# Altium project BC2087.PrjPcb (part 4 of 5)

## Sheet MID_AR0234.SchDoc: =project_title
size Tabloid; PageSetup: Record=PageOptions|CenterHorizontal=True|CenterVertical=True|PrintScale=0.71|XCorrection=1.00|YCorrection=1.00|PrintKind=0|BorderSize=5000000|LeftOffset=0|BottomOffset=0|Orientation=2|PaperLength=1000|PaperWidth=1000|Scale=100|PaperSource=7|PrintQuality=-4|MediaType=1|DitherType=10|PrintScaleMode=1|PaperKind=A4; CompanyName: Luxonis Holding; DrawnBy: Boris Chou / Blaz Kvas; Organization: Luxonis Holding; Address1: 1925 Harmony Park Drive; Address2: Westminster, CO; Address3: 80234; Address4: United States; DocumentNumber: D2088000; Revision: R3M1E3; SheetNumber: 5; SheetTotal: 11
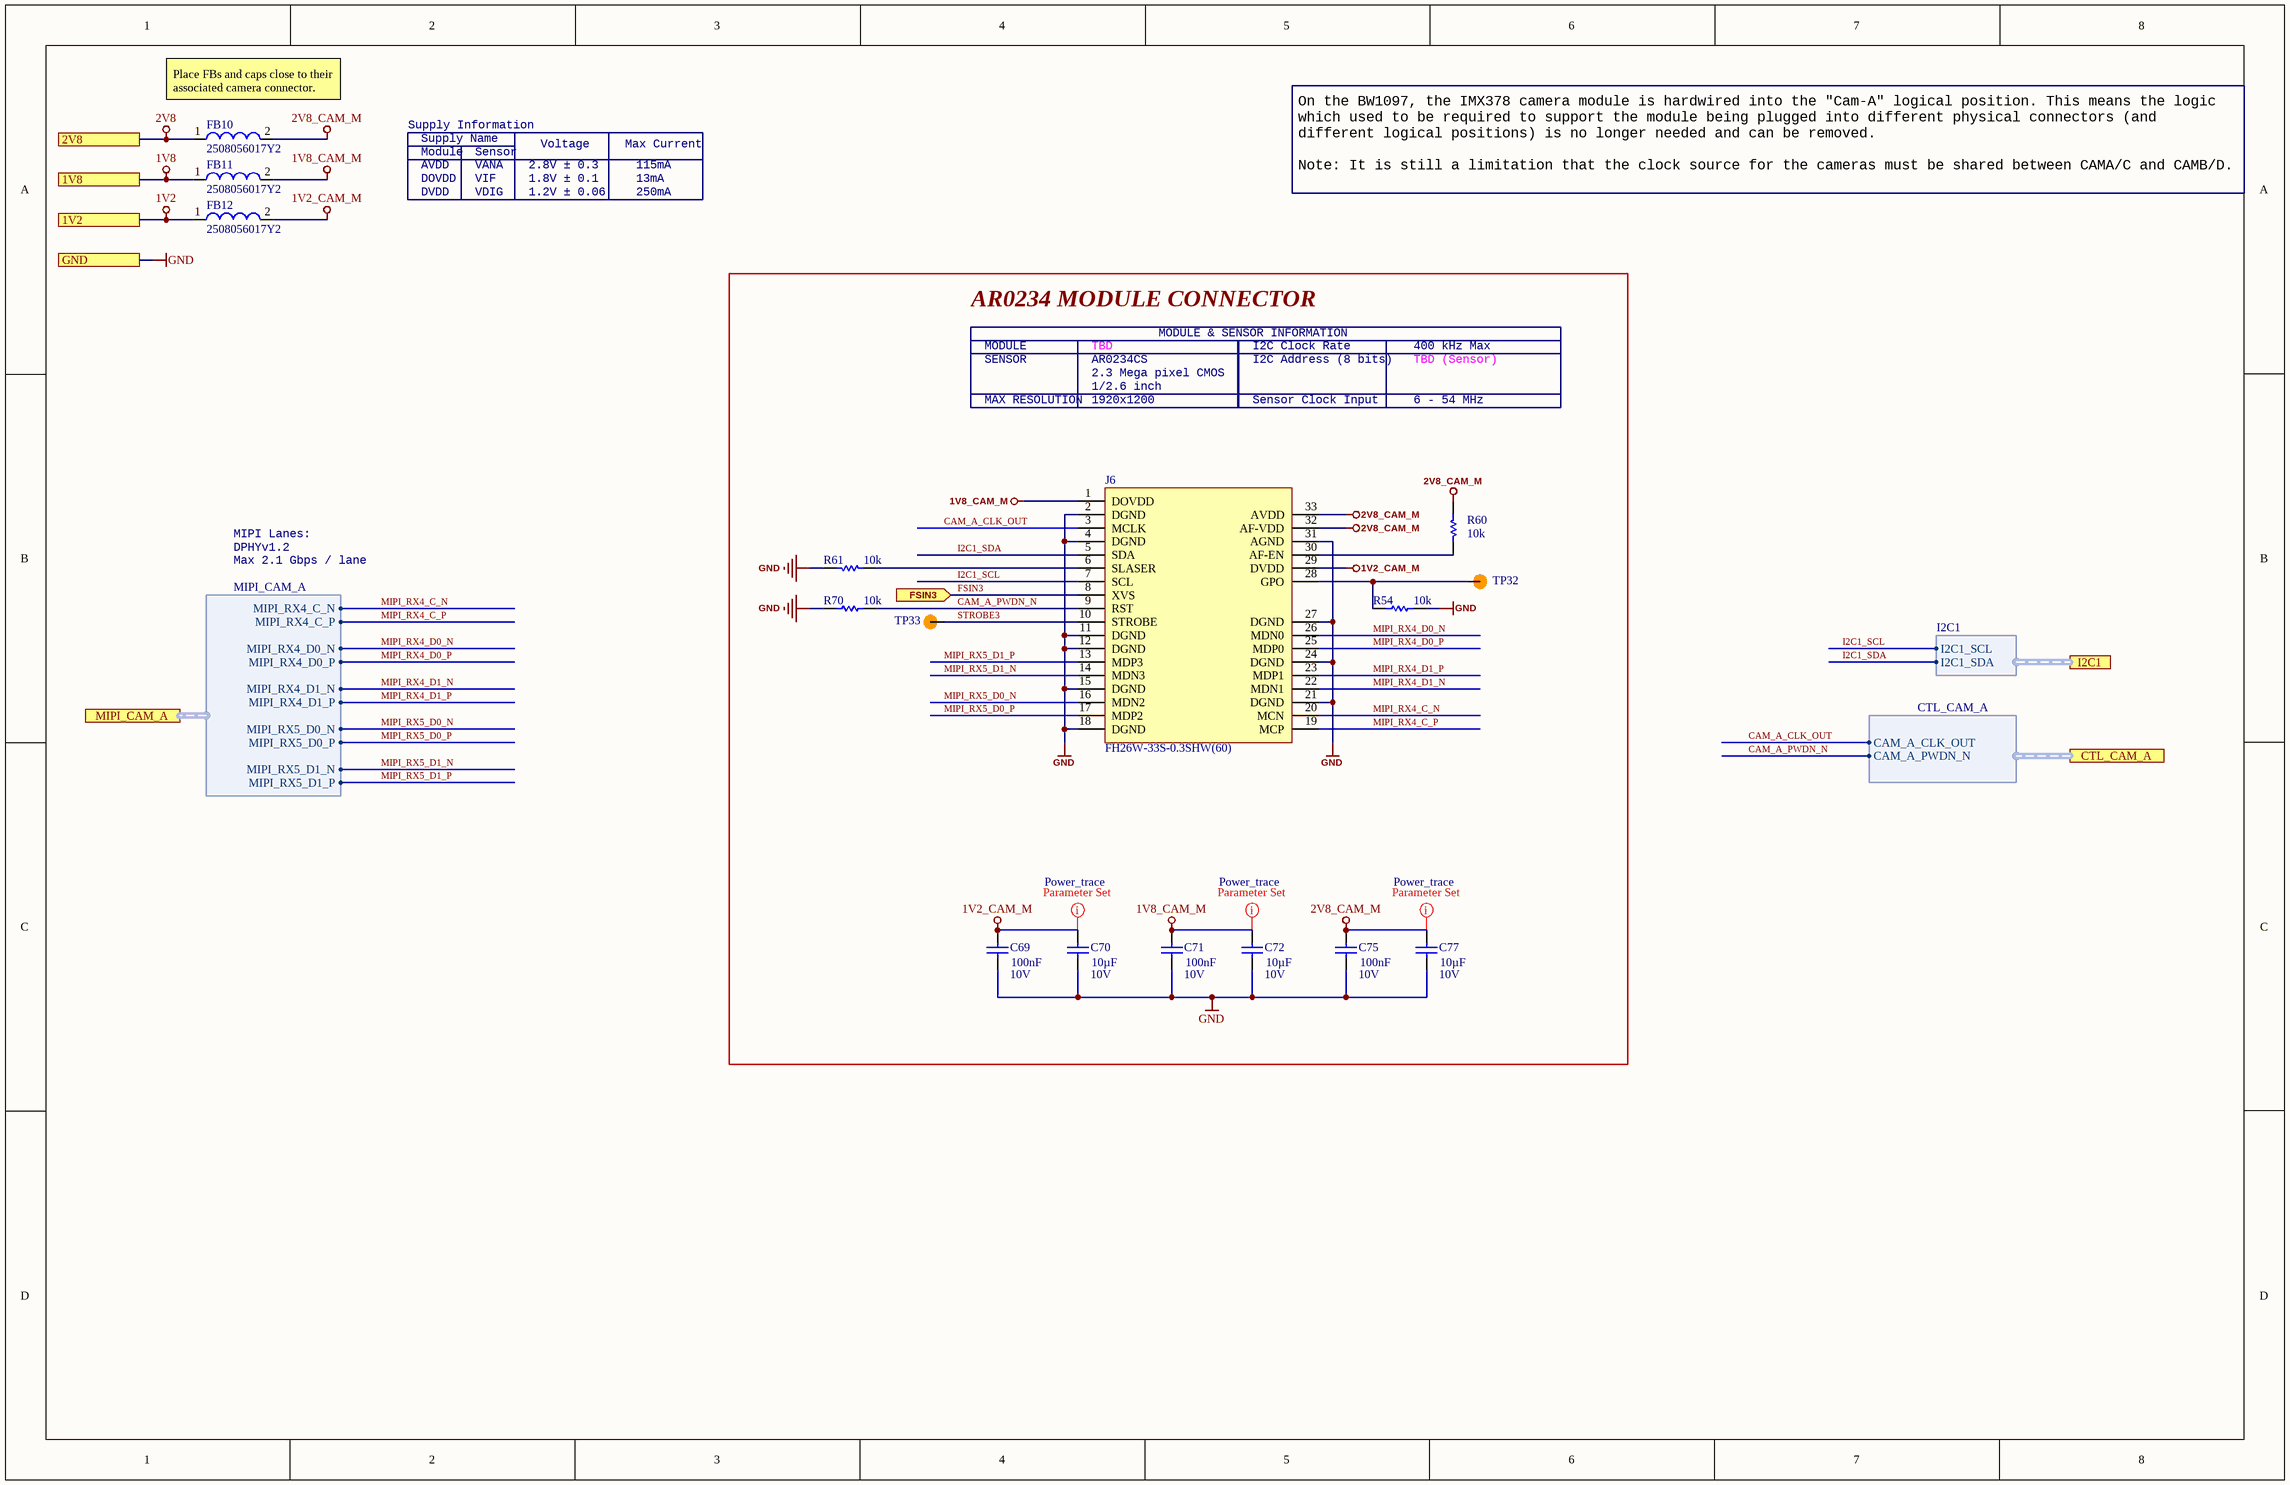
[diagram p10: MID_AR0234.SchDoc]

### Parts
C69  value 100nF  Voltage Rating: 10V  [CAPC0402(1005)70_L]  (hidden comment: GRM155R71A104JA01D)
C70  value 10µF  Voltage Rating: 10V  [CAPC0603(1608)100_L]  (hidden comment: GRM188R61A106ME69D)
C71  value 100nF  Voltage Rating: 10V  [CAPC0402(1005)70_L]  (hidden comment: GRM155R71A104JA01D)
C72  value 10µF  Voltage Rating: 10V  [CAPC0603(1608)100_L]  (hidden comment: GRM188R61A106ME69D)
C75  value 100nF  Voltage Rating: 10V  [CAPC0402(1005)70_L]  (hidden comment: GRM155R71A104JA01D)
C77  value 10µF  Voltage Rating: 10V  [CAPC0603(1608)100_L]  (hidden comment: GRM188R61A106ME69D)
FB10  2508056017Y2  [2508056017Y2]
FB11  2508056017Y2  [2508056017Y2]
FB12  2508056017Y2  [2508056017Y2]
J6  FH26W-33S-0.3SHW(60)  [FH26W-33S-0.3SHW(60)]
R54  value 10k  [RESC0402(1005)_L]  (hidden comment: RC0402FR-1310KL)
R60  value 10k  [RESC0402(1005)_L]  (hidden comment: RC0402FR-1310KL)
R61  value 10k  [RESC0402(1005)_L]  (hidden comment: RC0402FR-1310KL)
R70  value 10k  [RESC0402(1005)_L]  (hidden comment: RC0402FR-1310KL)
TP32  TEST_POINT  [TP100_200_NS]  (value not drawn)  (no BOM)
TP33  TEST_POINT  [TP100_200_NS]  (value not drawn)  (no BOM)

### Blocks framed on the sheet
AR0234 MODULE CONNECTOR: C69-C72 C75 C77 J6 R54 R60 R61 R70 TP32 TP33

### Ports
1V2, 1V8, 2V8, CTL_CAM_A (harness CTL_CAM_A), FSIN3 (in), GND, I2C1 (harness I2C1), MIPI_CAM_A (harness MIPI_CAM_A)

### Harnesses
I2C1: I2C1_SDA, I2C1_SCL
MIPI_CAM_A: MIPI_RX4_C_P, MIPI_RX4_C_N, MIPI_RX4_D0_P, MIPI_RX4_D0_N, MIPI_RX4_D1_P, MIPI_RX4_D1_N, MIPI_RX5_D0_P, MIPI_RX5_D0_N, MIPI_RX5_D1_P, MIPI_RX5_D1_N
CTL_CAM_A: CAM_A_PWDN_N, CAM_A_CLK_OUT

### Nets
1V2: FB12.1 ; port 1V2
1V2_CAM_M: C69.2 C70.2 FB12.2 J6.29(DVDD)
1V8: FB11.1 ; port 1V8
1V8_CAM_M: C71.2 C72.2 FB11.2 J6.1(DOVDD)
2V8: FB10.1 ; port 2V8
2V8_CAM_M: C75.2 C77.2 FB10.2 J6.32(AF-VDD) J6.33(AVDD) R60.1
GND: C69.1 C70.1 C71.1 C72.1 C75.1 C77.1 J6.2(DGND) J6.4(DGND) J6.11(DGND) J6.12(DGND) J6.15(DGND) J6.18(DGND) J6.21(DGND) J6.24(DGND) J6.27(DGND) J6.31(AGND) R54.2 R61.2 R70.1 ; port GND
CAM_A_CLK_OUT: J6.3(MCLK) ; port CTL_CAM_A.CAM_A_CLK_OUT
CAM_A_PWDN_N: J6.9(RST) R70.2 ; port CTL_CAM_A.CAM_A_PWDN_N
FSIN3: J6.8(XVS) ; port FSIN3
I2C1_SCL: J6.7(SCL) ; port I2C1.I2C1_SCL
I2C1_SDA: J6.5(SDA) ; port I2C1.I2C1_SDA
MIPI_RX4_C_N: J6.20(MCN) ; port MIPI_CAM_A.MIPI_RX4_C_N
MIPI_RX4_C_P: J6.19(MCP) ; port MIPI_CAM_A.MIPI_RX4_C_P
MIPI_RX4_D0_N: J6.26(MDN0) ; port MIPI_CAM_A.MIPI_RX4_D0_N
MIPI_RX4_D0_P: J6.25(MDP0) ; port MIPI_CAM_A.MIPI_RX4_D0_P
MIPI_RX4_D1_N: J6.22(MDN1) ; port MIPI_CAM_A.MIPI_RX4_D1_N
MIPI_RX4_D1_P: J6.23(MDP1) ; port MIPI_CAM_A.MIPI_RX4_D1_P
MIPI_RX5_D0_N: J6.16(MDN2) ; port MIPI_CAM_A.MIPI_RX5_D0_N
MIPI_RX5_D0_P: J6.17(MDP2) ; port MIPI_CAM_A.MIPI_RX5_D0_P
MIPI_RX5_D1_N: J6.14(MDN3) ; port MIPI_CAM_A.MIPI_RX5_D1_N
MIPI_RX5_D1_P: J6.13(MDP3) ; port MIPI_CAM_A.MIPI_RX5_D1_P
STROBE3: J6.10(STROBE) TP33.1
NetJ6_6: J6.6(SLASER) R61.1
NetJ6_28: J6.28(GPO) R54.1 TP32.1
NetJ6_30: J6.30(AF-EN) R60.2

### Layout directives
net class Power_trace: 1V2_CAM_M, 1V8_CAM_M, 2V8_CAM_M

### Notes on the sheet
- (near FB10) Place FBs and caps close to their associated camera connector.
- Supply Information
- AVDD
- Supply Name
- Module
- VANA
- Sensor
- 2.8V ± 0.3
- Voltage
- Max Current
- 115mA
- DOVDD
- DVDD
- VIF
- VDIG
- 1.8V ± 0.1
- 1.2V ± 0.06
- 13mA
- 250mA
- On the BW1097, the IMX378 camera module is hardwired into the "Cam-A" logical position. This means the logic which used to be required to support the module being plugged into different physical connectors (and different logical positions) is no longer needed and can be removed.
  Note: It is still a limitation that the clock source for the cameras must be shared between CAMA/C and CAMB/D.
- SENSOR
- MODULE
- AR0234CS
- TBD
- MODULE & SENSOR INFORMATION
- I2C Address (8 bits)
- I2C Clock Rate
- TBD (Sensor)
- 400 kHz Max
- MAX RESOLUTION
- 2.3 Mega pixel CMOS
- 1920x1200
- 1/2.6 inch
- Sensor Clock Input
- 6 - 54 MHz
- MIPI Lanes:
- Max 2.1 Gbps / lane
- DPHYv1.2
- Title
- Size:
- Date:
- Tabloid
- Number:
- Time:
- Revision:
- Sheet
- of
- Drawn by:

### Library data of the parts
C69 C71 C75 = CMP-108-000015-5: CAP CER 0.1UF 10V X7R 0402 5%; Manufacturer 1: Murata; Manufacturer Part Number 1: GRM155R71A104JA01D; Case/Package: 0402; Min Operating Temperature: -55°C; Max Operating Temperature: 125°C; Tolerance: 5%; Dielectric: X7R; Length: 1mm; Height: 0.5mm; Width: 0.02inch; Depth: 0.5mm; ComponentLink1URL: https://datasheet.ciiva.com/5411/product-5411135.pdf?src-supplier=Mouser; ComponentLink1Description: https://datasheet.ciiva.com/5411/product-5411135.pdf?src-supplier=Mouser; ComponentLink2URL: https://datasheet.ciiva.com/11618/c02e-11618821.pdf?src-supplier=Avnet; ComponentLink2Description: https://datasheet.ciiva.com/11618/c02e-11618821.pdf?src-supplier=Avnet; Design Item ID: GRM155R71A104JA01D; Mounting Technology: SMT
C70 C72 C77 = CMP-004-000018-4: CAP CER 10UF 10V X5R 0603 20%; Manufacturer 1: Murata; Manufacturer Part Number 1: GRM188R61A106ME69D; Case/Package: 0603; Min Operating Temperature: -55°C; Max Operating Temperature: 85°C; Tolerance: 20%; Dielectric: X5R; Length: 1.6mm; Height: 0.8mm; Width: 0.8mm; Depth: 0.8mm; ComponentLink1URL: http://www.mouser.com/ds/2/281/c02e-2905.pdf?src-supplier=Mouser; ComponentLink1Description: http://www.mouser.com/ds/2/281/c02e-2905.pdf?src-supplier=Mouser; ComponentLink2URL: http://components.arrow.com/part/dataview/0323_06119472?src-supplier=Arrow+Europe; ComponentLink2Description: http://components.arrow.com/part/dataview/0323_06119472?src-supplier=Arrow+Europe; ComponentLink3URL: http://www.farnell.com/datasheets/2048014.pdf?src-supplier=Farnell; ComponentLink3Description: http://www.farnell.com/datasheets/2048014.pdf?src-supplier=Farnell; ComponentLink4URL: http://www.farnell.com/datasheets/1872210.pdf?src-supplier=Farnell; ComponentLink4Description: http://www.farnell.com/datasheets/1872210.pdf?src-supplier=Farnell; ComponentLink5URL: http://search.murata.co.jp/Ceramy/image/img/A01X/G101/ENG/GRM188R61A106ME69-01.pdf?src-supplier=Digi-Key; ComponentLink5Description: http://search.murata.co.jp/Ceramy/image/img/A01X/G101/ENG/GRM188R61A106ME69-01.pdf?src-supplier=Digi-Key; ComponentLink6URL: http://www.farnell.com/datasheets/1872210.pdf?src-supplier=Newark; ComponentLink6Description: http://www.farnell.com/datasheets/1872210.pdf?src-supplier=Newark; ComponentLink7URL: http://www.farnell.com/datasheets/2048014.pdf?src-supplier=Element14; ComponentLink7Description: http://www.farnell.com/datasheets/2048014.pdf?src-supplier=Element14; ComponentLink8URL: http://www.farnell.com/datasheets/2048014.pdf?src-supplier=Newark; ComponentLink8Description: http://www.farnell.com/datasheets/2048014.pdf?src-supplier=Newark; Design Item ID: GRM188R61A106ME69D; Mounting Technology: SMT
FB10-FB12 = CMP-082-000000-2: FERRITE BEAD, 0.1OHM, 2A, 0805, 600R/100MHz; Manufacturer 1: Fair-Rite; Tolerance: 25%; Manufacturer Part Number 1: 2508056017Y2; Case/Package: 0805; Current Rating: 2A
J6 = CMP-002-00090-3: FFC/FPC Connector, 33 Contact(s), 1 Row(s), Female, Right Angle, Surface Mount Terminal; Manufacturer 1: Hirose; Manufacturer Part Number 1: FH26W-33S-0.3SHW(60); RoHS: Yes; Category: FFC / FPC; Stock 1: 627; Pricing 1: 1=1,78000, 10=1,61700, 25=1,51800, 50=1,45200, 100=1,38600, 250=1,25400, 500=1,15500, 1000=0,99000, 2500=0,92400 (USD); ComponentLink1URL: https://datasheet.ciiva.com:443/pdfs/VipMasterIC/IC/HIRO/HIRO-S-A0007913874/HIRO-S-A0008593114-1.pdf?src-supplier=IHS+Markit; ComponentLink1Description: https://datasheet.ciiva.com:443/pdfs/VipMasterIC/IC/HIRO/HIRO-S-A0007913874/HIRO-S-A0008593114-1.pdf?src-supplier=IHS+Markit; ComponentLink2URL: https://www.hirose.com/product/en/download_file/key_name/FH26/category/Catalog/doc_file_id/49355/?file_category_id=4&item_id=298&is_series=1&src-supplier=Digi-Key; ComponentLink2Description: https://www.hirose.com/product/en/download_file/key_name/FH26/category/Catalog/doc_file_id/49355/?file_category_id=4&item_id=298&is_series=1&src-supplier=Digi-Key; ComponentLink3URL: https://www.hirose.com/product/download/?distributor=digikey&amp;type=2d&amp;lang=en&amp;num=FH26W-13S-0.3SHW(60)&src-supplier=Digi-Key; ComponentLink3Description: https://www.hirose.com/product/download/?distributor=digikey&amp;type=2d&amp;lang=en&amp;num=FH26W-13S-0.3SHW(60)&src-supplier=Digi-Key; Design Item ID: FH26W-33S-0.3SHW(60); Pins: 33; Source: LuxonisMaster.SchLib
R54 R60 R61 R70 = CMP-115-000004-8: RES SMD 10K OHM 1% 1/16W 0402; Manufacturer 1: Yageo; Temperature Coefficient: 100ppm/°C; Power Rating: 62.5mW; Voltage Rating: 50V; Manufacturer Part Number 1: RC0402FR-1310KL; Case/Package: 0402; Min Operating Temperature: -55°C; Max Operating Temperature: 155°C; Tolerance: 1%; Design Item ID: RC0402FR-1310KL
TP32 TP33 = CMP-015-000000-2: Manufacturer Part Number 1: /; Design Item ID: TEST_POINT; Source: LuxonisMaster.SchLib

## Sheet RIGHT_AR0234.SchDoc: =project_title
size Tabloid; CompanyName: Luxonis Holding; DrawnBy: Boris Chou / Blaz Kvas; Organization: Luxonis Holding; Address1: 1925 Harmony Park Drive; Address2: Westminster, CO; Address3: 80234; Address4: United States; DocumentNumber: D2088000; Revision: R3M1E3; SheetNumber: 10; SheetTotal: 11
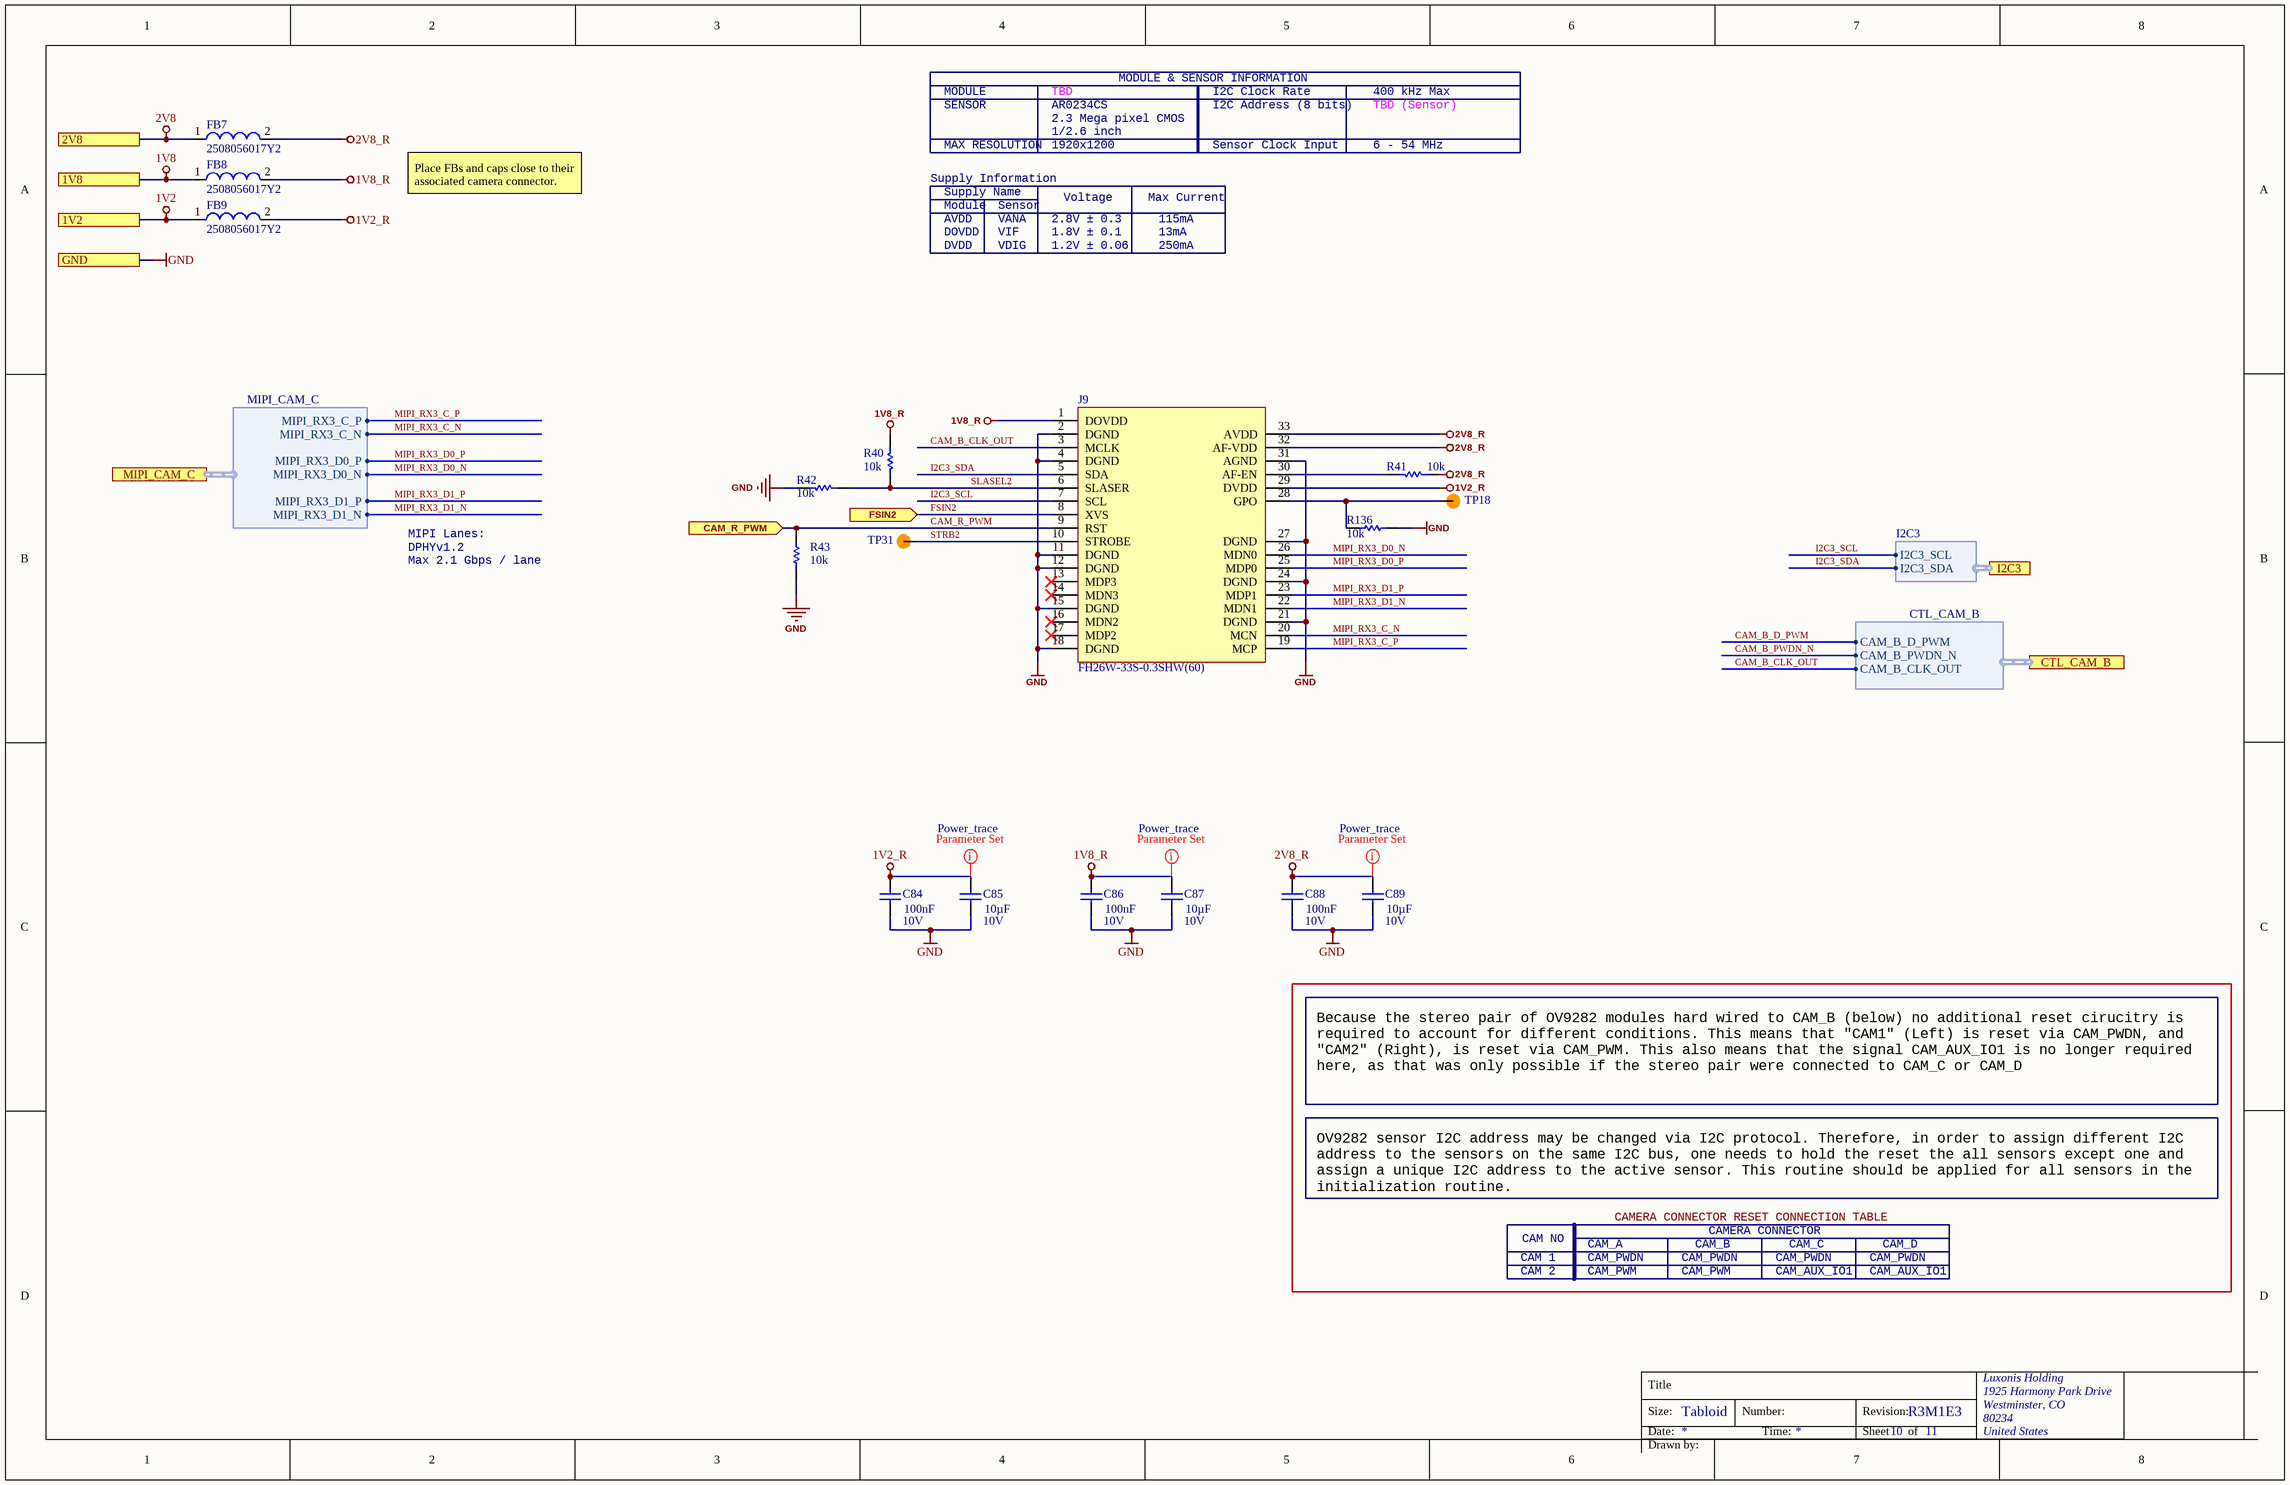
[diagram p11: RIGHT_AR0234.SchDoc]

### Parts
C84  value 100nF  Voltage Rating: 10V  [CAPC0402(1005)70_L]  (hidden comment: GRM155R71A104JA01D)
C85  value 10µF  Voltage Rating: 10V  [CAPC0603(1608)100_L]  (hidden comment: GRM188R61A106ME69D)
C86  value 100nF  Voltage Rating: 10V  [CAPC0402(1005)70_L]  (hidden comment: GRM155R71A104JA01D)
C87  value 10µF  Voltage Rating: 10V  [CAPC0603(1608)100_L]  (hidden comment: GRM188R61A106ME69D)
C88  value 100nF  Voltage Rating: 10V  [CAPC0402(1005)70_L]  (hidden comment: GRM155R71A104JA01D)
C89  value 10µF  Voltage Rating: 10V  [CAPC0603(1608)100_L]  (hidden comment: GRM188R61A106ME69D)
FB7  2508056017Y2  [2508056017Y2]
FB8  2508056017Y2  [2508056017Y2]
FB9  2508056017Y2  [2508056017Y2]
J9  FH26W-33S-0.3SHW(60)  [FH26W-33S-0.3SHW(60)]
R40  value 10k  [RESC0402(1005)_L]  (hidden comment: RC0402FR-1310KL)
R41  value 10k  [RESC0402(1005)_L]  (hidden comment: RC0402FR-1310KL)
R42  value 10k  [RESC0402(1005)_L]  (hidden comment: RC0402FR-1310KL)
R43  value 10k  [RESC0402(1005)_L]  (hidden comment: RC0402FR-1310KL)
R136  value 10k  [RESC0402(1005)_L]  (hidden comment: RC0402FR-1310KL)
TP18  TEST_POINT  [TP100_200_NS]  (value not drawn)  (no BOM)
TP31  TEST_POINT  [TP100_200_NS]  (value not drawn)  (no BOM)

### Ports
1V2, 1V8, 2V8, CAM_R_PWM (in), CTL_CAM_B (harness CTL_CAM_B), FSIN2 (in), GND, I2C3 (harness I2C3), MIPI_CAM_C (harness MIPI_CAM_C)

### Harnesses
MIPI_CAM_C: MIPI_RX3_C_P, MIPI_RX3_C_N, MIPI_RX3_D0_P, MIPI_RX3_D0_N, MIPI_RX3_D1_P, MIPI_RX3_D1_N
I2C3: I2C3_SDA, I2C3_SCL
CTL_CAM_B: CAM_B_CLK_OUT, CAM_B_PWDN_N, CAM_B_D_PWM

### Nets
1V2: FB9.1 ; port 1V2
1V2_R: C84.2 C85.2 FB9.2 J9.29(DVDD)
1V8: FB8.1 ; port 1V8
1V8_R: C86.2 C87.2 FB8.2 J9.1(DOVDD) R40.1
2V8: FB7.1 ; port 2V8
2V8_R: C88.2 C89.2 FB7.2 J9.32(AF-VDD) J9.33(AVDD) R41.2
GND: C84.1 C85.1 C86.1 C87.1 C88.1 C89.1 J9.2(DGND) J9.4(DGND) J9.11(DGND) J9.12(DGND) J9.15(DGND) J9.18(DGND) J9.21(DGND) J9.24(DGND) J9.27(DGND) J9.31(AGND) R42.1 R43.1 R136.2 ; port GND
CAM_B_CLK_OUT: J9.3(MCLK) ; port CTL_CAM_B.CAM_B_CLK_OUT
CAM_R_PWM: J9.9(RST) R43.2 ; port CAM_R_PWM
FSIN2: J9.8(XVS) ; port FSIN2
I2C3_SCL: J9.7(SCL) ; port I2C3.I2C3_SCL
I2C3_SDA: J9.5(SDA) ; port I2C3.I2C3_SDA
MIPI_RX3_C_N: J9.20(MCN) ; port MIPI_CAM_C.MIPI_RX3_C_N
MIPI_RX3_C_P: J9.19(MCP) ; port MIPI_CAM_C.MIPI_RX3_C_P
MIPI_RX3_D0_N: J9.26(MDN0) ; port MIPI_CAM_C.MIPI_RX3_D0_N
MIPI_RX3_D0_P: J9.25(MDP0) ; port MIPI_CAM_C.MIPI_RX3_D0_P
MIPI_RX3_D1_N: J9.22(MDN1) ; port MIPI_CAM_C.MIPI_RX3_D1_N
MIPI_RX3_D1_P: J9.23(MDP1) ; port MIPI_CAM_C.MIPI_RX3_D1_P
SLASEL2: J9.6(SLASER) R40.2 R42.2
STRB2: J9.10(STROBE) TP31.1
NetJ9_28: J9.28(GPO) R136.1 TP18.1
NetJ9_30: J9.30(AF-EN) R41.1

Not connected (* = marked no-connect by the designer): J9 13(MDP3)* 14(MDN3)* 16(MDN2)* 17(MDP2)*

### Layout directives
net class Power_trace: 1V2_R, 1V8_R, 2V8_R

### Notes on the sheet
- MODULE
- TBD
- MODULE & SENSOR INFORMATION
- I2C Clock Rate
- 400 kHz Max
- SENSOR
- MAX RESOLUTION
- 2.3 Mega pixel CMOS
- 1920x1200
- AR0234CS
- 1/2.6 inch
- I2C Address (8 bits)
- Sensor Clock Input
- TBD (Sensor)
- 6 - 54 MHz
- Place FBs and caps close to their associated camera connector.
- Supply Information
- AVDD
- Supply Name
- Module
- VANA
- Sensor
- 2.8V ± 0.3
- Voltage
- Max Current
- 115mA
- DOVDD
- DVDD
- VIF
- VDIG
- 1.8V ± 0.1
- 1.2V ± 0.06
- 13mA
- 250mA
- MIPI Lanes:
- Max 2.1 Gbps / lane
- DPHYv1.2
- Because the stereo pair of OV9282 modules hard wired to CAM_B (below) no additional reset cirucitry is required to account for different conditions. This means that "CAM1" (Left) is reset via CAM_PWDN, and "CAM2" (Right), is reset via CAM_PWM. This also means that the signal CAM_AUX_IO1 is no longer required here, as that was only possible if the stereo pair were connected to CAM_C or CAM_D
- OV9282 sensor I2C address may be changed via I2C protocol. Therefore, in order to assign different I2C address to the sensors on the same I2C bus, one needs to hold the reset the all sensors except one and assign a unique I2C address to the active sensor. This routine should be applied for all sensors in the initialization routine.
- CAMERA CONNECTOR RESET CONNECTION TABLE
- CAMERA CONNECTOR
- CAM 1
- CAM 2
- CAM NO
- CAM_A
- CAM_PWDN
- CAM_PWM
- CAM_B
- CAM_AUX_IO1
- CAM_C
- CAM_D
- Title
- Size:
- Date:
- Tabloid
- Number:
- Time:
- Revision:
- Sheet
- of
- Drawn by:

### Library data of the parts
C84 C86 C88 = CMP-108-000015-5: as C69 on sheet MID_AR0234; Manufacturer Part Number 1: GRM155R71A104JA01D; Case/Package: 0402; Min Operating Temperature: -55°C; Max Operating Temperature: 125°C; Tolerance: 5%; Dielectric: X7R; Length: 1mm; Height: 0.5mm; Width: 0.02inch; Depth: 0.5mm; ComponentLink1URL: https://datasheet.ciiva.com/5411/product-5411135.pdf?src-supplier=Mouser; ComponentLink1Description: https://datasheet.ciiva.com/5411/product-5411135.pdf?src-supplier=Mouser; ComponentLink2URL: https://datasheet.ciiva.com/11618/c02e-11618821.pdf?src-supplier=Avnet; ComponentLink2Description: https://datasheet.ciiva.com/11618/c02e-11618821.pdf?src-supplier=Avnet; Design Item ID: GRM155R71A104JA01D; Mounting Technology: SMT
C85 C87 C89 = CMP-004-000018-4: as C70 on sheet MID_AR0234; Manufacturer Part Number 1: GRM188R61A106ME69D; Case/Package: 0603; Min Operating Temperature: -55°C; Max Operating Temperature: 85°C; Tolerance: 20%; Dielectric: X5R; Length: 1.6mm; Height: 0.8mm; Width: 0.8mm; Depth: 0.8mm; ComponentLink1URL: http://www.mouser.com/ds/2/281/c02e-2905.pdf?src-supplier=Mouser; ComponentLink1Description: http://www.mouser.com/ds/2/281/c02e-2905.pdf?src-supplier=Mouser; ComponentLink2URL: http://components.arrow.com/part/dataview/0323_06119472?src-supplier=Arrow+Europe; ComponentLink2Description: http://components.arrow.com/part/dataview/0323_06119472?src-supplier=Arrow+Europe; ComponentLink3URL: http://www.farnell.com/datasheets/2048014.pdf?src-supplier=Farnell; ComponentLink3Description: http://www.farnell.com/datasheets/2048014.pdf?src-supplier=Farnell; ComponentLink4URL: http://www.farnell.com/datasheets/1872210.pdf?src-supplier=Farnell; ComponentLink4Description: http://www.farnell.com/datasheets/1872210.pdf?src-supplier=Farnell; ComponentLink5URL: http://search.murata.co.jp/Ceramy/image/img/A01X/G101/ENG/GRM188R61A106ME69-01.pdf?src-supplier=Digi-Key; ComponentLink5Description: http://search.murata.co.jp/Ceramy/image/img/A01X/G101/ENG/GRM188R61A106ME69-01.pdf?src-supplier=Digi-Key; ComponentLink6URL: http://www.farnell.com/datasheets/1872210.pdf?src-supplier=Newark; ComponentLink6Description: http://www.farnell.com/datasheets/1872210.pdf?src-supplier=Newark; ComponentLink7URL: http://www.farnell.com/datasheets/2048014.pdf?src-supplier=Element14; ComponentLink7Description: http://www.farnell.com/datasheets/2048014.pdf?src-supplier=Element14; ComponentLink8URL: http://www.farnell.com/datasheets/2048014.pdf?src-supplier=Newark; ComponentLink8Description: http://www.farnell.com/datasheets/2048014.pdf?src-supplier=Newark; Design Item ID: GRM188R61A106ME69D; Mounting Technology: SMT
FB7-FB9 = CMP-082-000000-2: as FB10 on sheet MID_AR0234; Manufacturer Part Number 1: 2508056017Y2; Case/Package: 0805; Current Rating: 2A
J9 = CMP-002-00090-3: as J6 on sheet MID_AR0234; Manufacturer Part Number 1: FH26W-33S-0.3SHW(60); RoHS: Yes; Category: FFC / FPC; Stock 1: 627; Pricing 1: 1=1,78000, 10=1,61700, 25=1,51800, 50=1,45200, 100=1,38600, 250=1,25400, 500=1,15500, 1000=0,99000, 2500=0,92400 (USD); ComponentLink1URL: https://datasheet.ciiva.com:443/pdfs/VipMasterIC/IC/HIRO/HIRO-S-A0007913874/HIRO-S-A0008593114-1.pdf?src-supplier=IHS+Markit; ComponentLink1Description: https://datasheet.ciiva.com:443/pdfs/VipMasterIC/IC/HIRO/HIRO-S-A0007913874/HIRO-S-A0008593114-1.pdf?src-supplier=IHS+Markit; ComponentLink2URL: https://www.hirose.com/product/en/download_file/key_name/FH26/category/Catalog/doc_file_id/49355/?file_category_id=4&item_id=298&is_series=1&src-supplier=Digi-Key; ComponentLink2Description: https://www.hirose.com/product/en/download_file/key_name/FH26/category/Catalog/doc_file_id/49355/?file_category_id=4&item_id=298&is_series=1&src-supplier=Digi-Key; ComponentLink3URL: https://www.hirose.com/product/download/?distributor=digikey&amp;type=2d&amp;lang=en&amp;num=FH26W-13S-0.3SHW(60)&src-supplier=Digi-Key; ComponentLink3Description: https://www.hirose.com/product/download/?distributor=digikey&amp;type=2d&amp;lang=en&amp;num=FH26W-13S-0.3SHW(60)&src-supplier=Digi-Key; Design Item ID: FH26W-33S-0.3SHW(60); Pins: 33; Source: LuxonisMaster.SchLib
R40-R43 R136 = CMP-115-000004-8: as R54 on sheet MID_AR0234; Manufacturer Part Number 1: RC0402FR-1310KL; Case/Package: 0402; Min Operating Temperature: -55°C; Max Operating Temperature: 155°C; Tolerance: 1%; Design Item ID: RC0402FR-1310KL
TP18 TP31 = CMP-015-000000-2: Manufacturer Part Number 1: /; Design Item ID: TEST_POINT; Source: LuxonisMaster.SchLib

## Sheet LEFT_AR0234.SchDoc: =project_title
size Tabloid; PageSetup: Record=PageOptions|CenterHorizontal=True|CenterVertical=True|PrintScale=0.71|XCorrection=1.00|YCorrection=1.00|PrintKind=0|BorderSize=5000000|LeftOffset=0|BottomOffset=0|Orientation=2|PaperLength=1000|PaperWidth=1000|Scale=100|PaperSource=7|PrintQuality=-4|MediaType=1|DitherType=10|PrintScaleMode=1|PaperKind=A4; CompanyName: Luxonis Holding; DrawnBy: Boris Chou / Blaz Kvas; Organization: Luxonis Holding; Address1: 1925 Harmony Park Drive; Address2: Westminster, CO; Address3: 80234; Address4: United States; DocumentNumber: D2088000; Revision: R3M1E3; SheetNumber: 6; SheetTotal: 11
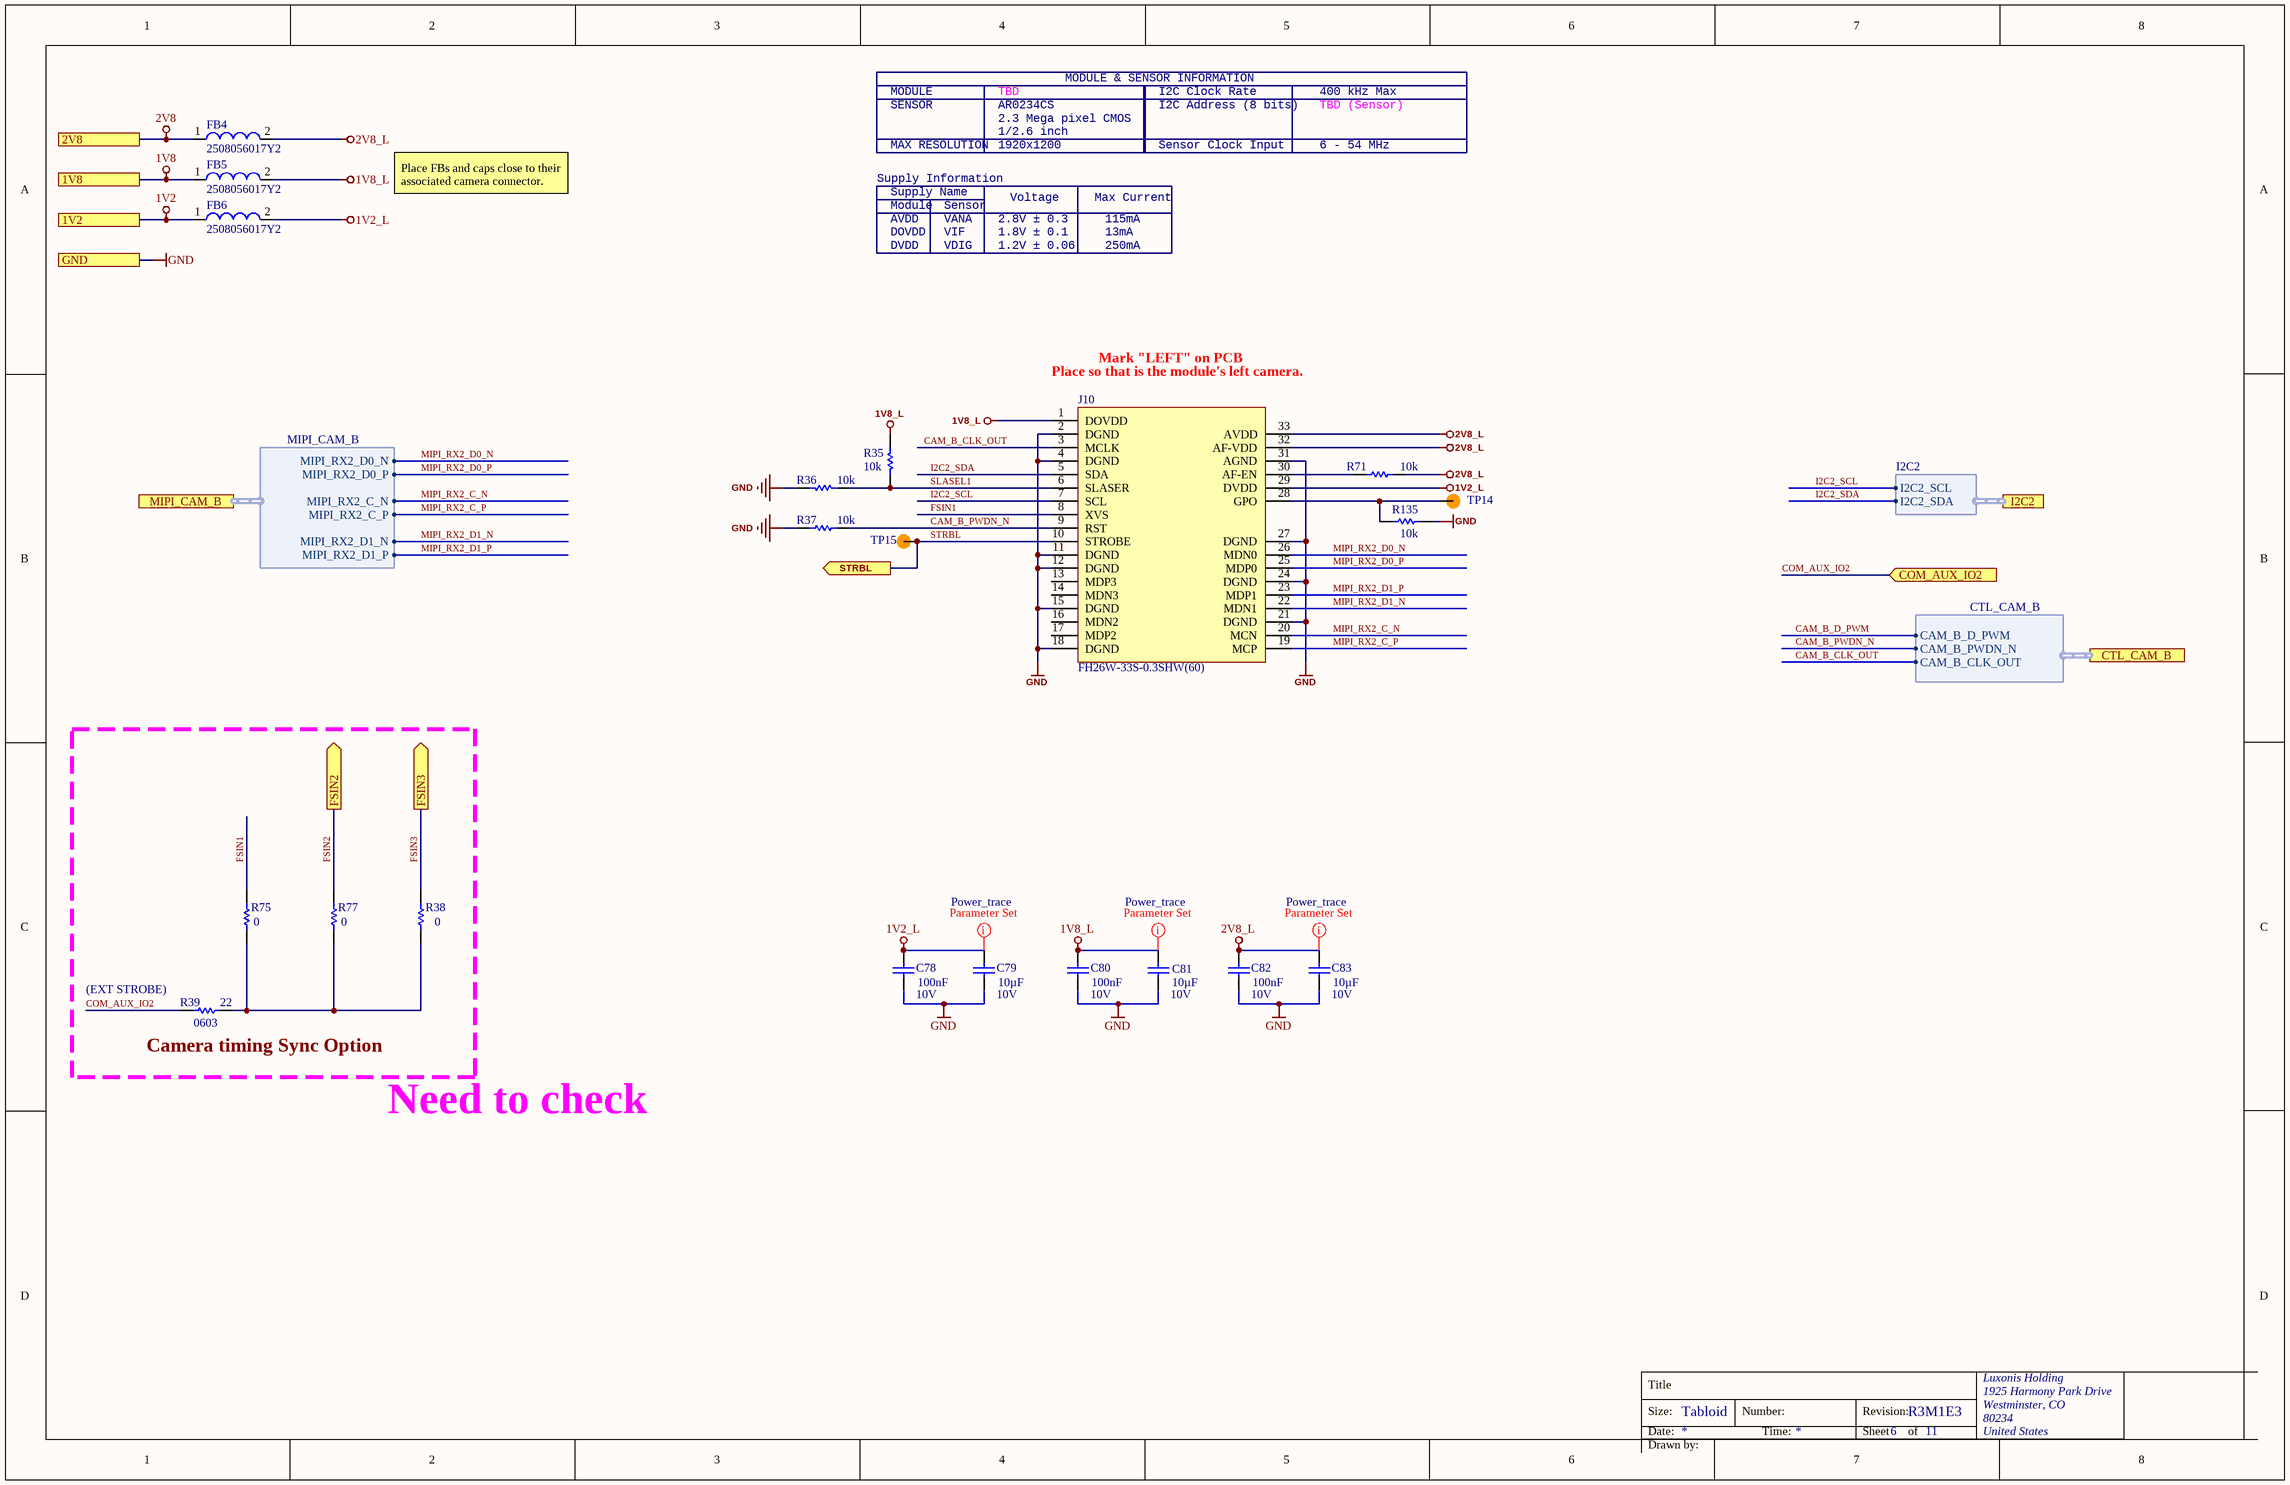
[diagram p12: LEFT_AR0234.SchDoc]

### Parts
C78  value 100nF  Voltage Rating: 10V  [CAPC0402(1005)70_L]  (hidden comment: GRM155R71A104JA01D)
C79  value 10µF  Voltage Rating: 10V  [CAPC0603(1608)100_L]  (hidden comment: GRM188R61A106ME69D)
C80  value 100nF  Voltage Rating: 10V  [CAPC0402(1005)70_L]  (hidden comment: GRM155R71A104JA01D)
C81  value 10µF  Voltage Rating: 10V  [CAPC0603(1608)100_L]  (hidden comment: GRM188R61A106ME69D)
C82  value 100nF  Voltage Rating: 10V  [CAPC0402(1005)70_L]  (hidden comment: GRM155R71A104JA01D)
C83  value 10µF  Voltage Rating: 10V  [CAPC0603(1608)100_L]  (hidden comment: GRM188R61A106ME69D)
FB4  2508056017Y2  [2508056017Y2]
FB5  2508056017Y2  [2508056017Y2]
FB6  2508056017Y2  [2508056017Y2]
J10  FH26W-33S-0.3SHW(60)  [FH26W-33S-0.3SHW(60)]
R35  value 10k  [RESC0402(1005)_L]  (hidden comment: RC0402FR-1310KL)
R36  value 10k  [RESC0402(1005)_L]  (hidden comment: RC0402FR-1310KL)
R37  value 10k  [RESC0402(1005)_L]  (hidden comment: RC0402FR-1310KL)
R38  value 0  [RESC0603(1608)_L]  (hidden comment: CRCW06030000Z0EA)
R39  value 22  Case/Package: 0603  [RESC0603(1608)_L]  (hidden comment: RC0603FR-0722RL)
R71  value 10k  [RESC0402(1005)_L]  (hidden comment: RC0402FR-1310KL)
R75  value 0  [RESC0603(1608)_L]  (hidden comment: CRCW06030000Z0EA)
R77  value 0  [RESC0603(1608)_L]  (hidden comment: CRCW06030000Z0EA)
R135  value 10k  [RESC0402(1005)_L]  (hidden comment: RC0402FR-1310KL)
TP14  TEST_POINT  [TP100_200_NS]  (value not drawn)  (no BOM)
TP15  TEST_POINT  [TP100_200_NS]  (value not drawn)  (no BOM)

### Blocks framed on the sheet
Camera timing Sync Option: R38 R39 R75 R77

### Ports
1V2, 1V8, 2V8, COM_AUX_IO2 (in), CTL_CAM_B (harness CTL_CAM_B), FSIN2 (out), FSIN3 (out), GND, I2C2 (harness I2C2), MIPI_CAM_B (harness MIPI_CAM_B), STRBL (out)

### Harnesses
I2C2: I2C2_SDA, I2C2_SCL
MIPI_CAM_B: MIPI_RX2_D1_P, MIPI_RX2_D1_N, MIPI_RX2_D0_N, MIPI_RX2_D0_P, MIPI_RX2_C_N, MIPI_RX2_C_P
CTL_CAM_B: CAM_B_CLK_OUT, CAM_B_PWDN_N, CAM_B_D_PWM

### Nets
1V2: FB6.1 ; port 1V2
1V2_L: C78.2 C79.2 FB6.2 J10.29(DVDD)
1V8: FB5.1 ; port 1V8
1V8_L: C80.2 C81.2 FB5.2 J10.1(DOVDD) R35.1
2V8: FB4.1 ; port 2V8
2V8_L: C82.2 C83.2 FB4.2 J10.32(AF-VDD) J10.33(AVDD) R71.2
GND: C78.1 C79.1 C80.1 C81.1 C82.1 C83.1 J10.2(DGND) J10.4(DGND) J10.11(DGND) J10.12(DGND) J10.15(DGND) J10.18(DGND) J10.21(DGND) J10.24(DGND) J10.27(DGND) J10.31(AGND) R36.1 R37.2 R135.2 ; port GND
CAM_B_CLK_OUT: J10.3(MCLK) ; port CTL_CAM_B.CAM_B_CLK_OUT
CAM_B_PWDN_N: J10.9(RST) R37.1 ; port CTL_CAM_B.CAM_B_PWDN_N
COM_AUX_IO2: R39.2 ; port COM_AUX_IO2
FSIN1: J10.8(XVS) R75.2
FSIN2: R77.2 ; port FSIN2
FSIN3: R38.2 ; port FSIN3
I2C2_SCL: J10.7(SCL) ; port I2C2.I2C2_SCL
I2C2_SDA: J10.5(SDA) ; port I2C2.I2C2_SDA
MIPI_RX2_C_N: J10.20(MCN) ; port MIPI_CAM_B.MIPI_RX2_C_N
MIPI_RX2_C_P: J10.19(MCP) ; port MIPI_CAM_B.MIPI_RX2_C_P
MIPI_RX2_D0_N: J10.26(MDN0) ; port MIPI_CAM_B.MIPI_RX2_D0_N
MIPI_RX2_D0_P: J10.25(MDP0) ; port MIPI_CAM_B.MIPI_RX2_D0_P
MIPI_RX2_D1_N: J10.22(MDN1) ; port MIPI_CAM_B.MIPI_RX2_D1_N
MIPI_RX2_D1_P: J10.23(MDP1) ; port MIPI_CAM_B.MIPI_RX2_D1_P
SLASEL1: J10.6(SLASER) R35.2 R36.2
STRBL: J10.10(STROBE) TP15.1 ; port STRBL
NetJ10_28: J10.28(GPO) R135.1 TP14.1
NetJ10_30: J10.30(AF-EN) R71.1
NetR38_1: R38.1 R39.1 R75.1 R77.1

Not connected (* = marked no-connect by the designer): J10 13(MDP3) 14(MDN3) 16(MDN2) 17(MDP2)

### Layout directives
net class Power_trace: 1V2_L, 1V8_L, 2V8_L

### Notes on the sheet
- MODULE
- TBD
- MODULE & SENSOR INFORMATION
- I2C Clock Rate
- 400 kHz Max
- SENSOR
- MAX RESOLUTION
- 2.3 Mega pixel CMOS
- 1920x1200
- AR0234CS
- 1/2.6 inch
- I2C Address (8 bits)
- Sensor Clock Input
- TBD (Sensor)
- 6 - 54 MHz
- Place FBs and caps close to their associated camera connector.
- Supply Information
- AVDD
- Supply Name
- Module
- VANA
- Sensor
- 2.8V ± 0.3
- Voltage
- Max Current
- 115mA
- DOVDD
- DVDD
- VIF
- VDIG
- 1.8V ± 0.1
- 1.2V ± 0.06
- 13mA
- 250mA
- Mark "LEFT" on PCB
- (near J10) Place so that is the module's left camera.
- (near R39) (EXT STROBE)
- Need to check
- Title
- Size:
- Date:
- Tabloid
- Number:
- Time:
- Revision:
- Sheet
- of
- Drawn by:

### Library data of the parts
C78 C80 C82 = CMP-108-000015-5: as C69 on sheet MID_AR0234; Manufacturer Part Number 1: GRM155R71A104JA01D; Case/Package: 0402; Min Operating Temperature: -55°C; Max Operating Temperature: 125°C; Tolerance: 5%; Dielectric: X7R; Length: 1mm; Height: 0.5mm; Width: 0.02inch; Depth: 0.5mm; ComponentLink1URL: https://datasheet.ciiva.com/5411/product-5411135.pdf?src-supplier=Mouser; ComponentLink1Description: https://datasheet.ciiva.com/5411/product-5411135.pdf?src-supplier=Mouser; ComponentLink2URL: https://datasheet.ciiva.com/11618/c02e-11618821.pdf?src-supplier=Avnet; ComponentLink2Description: https://datasheet.ciiva.com/11618/c02e-11618821.pdf?src-supplier=Avnet; Design Item ID: GRM155R71A104JA01D; Mounting Technology: SMT
C79 C81 C83 = CMP-004-000018-4: as C70 on sheet MID_AR0234; Manufacturer Part Number 1: GRM188R61A106ME69D; Case/Package: 0603; Min Operating Temperature: -55°C; Max Operating Temperature: 85°C; Tolerance: 20%; Dielectric: X5R; Length: 1.6mm; Height: 0.8mm; Width: 0.8mm; Depth: 0.8mm; ComponentLink1URL: http://www.mouser.com/ds/2/281/c02e-2905.pdf?src-supplier=Mouser; ComponentLink1Description: http://www.mouser.com/ds/2/281/c02e-2905.pdf?src-supplier=Mouser; ComponentLink2URL: http://components.arrow.com/part/dataview/0323_06119472?src-supplier=Arrow+Europe; ComponentLink2Description: http://components.arrow.com/part/dataview/0323_06119472?src-supplier=Arrow+Europe; ComponentLink3URL: http://www.farnell.com/datasheets/2048014.pdf?src-supplier=Farnell; ComponentLink3Description: http://www.farnell.com/datasheets/2048014.pdf?src-supplier=Farnell; ComponentLink4URL: http://www.farnell.com/datasheets/1872210.pdf?src-supplier=Farnell; ComponentLink4Description: http://www.farnell.com/datasheets/1872210.pdf?src-supplier=Farnell; ComponentLink5URL: http://search.murata.co.jp/Ceramy/image/img/A01X/G101/ENG/GRM188R61A106ME69-01.pdf?src-supplier=Digi-Key; ComponentLink5Description: http://search.murata.co.jp/Ceramy/image/img/A01X/G101/ENG/GRM188R61A106ME69-01.pdf?src-supplier=Digi-Key; ComponentLink6URL: http://www.farnell.com/datasheets/1872210.pdf?src-supplier=Newark; ComponentLink6Description: http://www.farnell.com/datasheets/1872210.pdf?src-supplier=Newark; ComponentLink7URL: http://www.farnell.com/datasheets/2048014.pdf?src-supplier=Element14; ComponentLink7Description: http://www.farnell.com/datasheets/2048014.pdf?src-supplier=Element14; ComponentLink8URL: http://www.farnell.com/datasheets/2048014.pdf?src-supplier=Newark; ComponentLink8Description: http://www.farnell.com/datasheets/2048014.pdf?src-supplier=Newark; Design Item ID: GRM188R61A106ME69D; Mounting Technology: SMT
FB4-FB6 = CMP-082-000000-2: as FB10 on sheet MID_AR0234; Manufacturer Part Number 1: 2508056017Y2; Case/Package: 0805; Current Rating: 2A
J10 = CMP-002-00090-3: as J6 on sheet MID_AR0234; Manufacturer Part Number 1: FH26W-33S-0.3SHW(60); RoHS: Yes; Category: FFC / FPC; Stock 1: 627; Pricing 1: 1=1,78000, 10=1,61700, 25=1,51800, 50=1,45200, 100=1,38600, 250=1,25400, 500=1,15500, 1000=0,99000, 2500=0,92400 (USD); ComponentLink1URL: https://datasheet.ciiva.com:443/pdfs/VipMasterIC/IC/HIRO/HIRO-S-A0007913874/HIRO-S-A0008593114-1.pdf?src-supplier=IHS+Markit; ComponentLink1Description: https://datasheet.ciiva.com:443/pdfs/VipMasterIC/IC/HIRO/HIRO-S-A0007913874/HIRO-S-A0008593114-1.pdf?src-supplier=IHS+Markit; ComponentLink2URL: https://www.hirose.com/product/en/download_file/key_name/FH26/category/Catalog/doc_file_id/49355/?file_category_id=4&item_id=298&is_series=1&src-supplier=Digi-Key; ComponentLink2Description: https://www.hirose.com/product/en/download_file/key_name/FH26/category/Catalog/doc_file_id/49355/?file_category_id=4&item_id=298&is_series=1&src-supplier=Digi-Key; ComponentLink3URL: https://www.hirose.com/product/download/?distributor=digikey&amp;type=2d&amp;lang=en&amp;num=FH26W-13S-0.3SHW(60)&src-supplier=Digi-Key; ComponentLink3Description: https://www.hirose.com/product/download/?distributor=digikey&amp;type=2d&amp;lang=en&amp;num=FH26W-13S-0.3SHW(60)&src-supplier=Digi-Key; Design Item ID: FH26W-33S-0.3SHW(60); Pins: 33; Source: LuxonisMaster.SchLib
R35-R37 R71 R135 = CMP-115-000004-8: as R54 on sheet MID_AR0234; Manufacturer Part Number 1: RC0402FR-1310KL; Case/Package: 0402; Min Operating Temperature: -55°C; Max Operating Temperature: 155°C; Tolerance: 1%; Design Item ID: RC0402FR-1310KL
R38 R75 R77 = CMP-115-000011-7: RES SMD 0 OHM 5% 1/10W 0603; Manufacturer 1: Vishay; Manufacturer Part Number 1: CRCW0603-0000Z0EA; Power Rating: 100mW; Voltage Rating: 75V; Temperature Coefficient: 100ppm/°C; Case/Package: 0603; Min Operating Temperature: -55°C; Max Operating Temperature: 155°C; Tolerance: 5%; Design Item ID: CRCW06030000Z0EA
R39 = CMP-013-000020-8: RES SMD 22 OHM 1% 1/10W 0603; Manufacturer 1: Yageo; Power Rating: 100mW; Voltage Rating: 50V; Manufacturer Part Number 1: RC0603FR-0722RL; Min Operating Temperature: -55°C; Max Operating Temperature: 155°C; Tolerance: 1%; Design Item ID: RC0603FR-0722RL
TP14 TP15 = CMP-015-000000-2: Manufacturer Part Number 1: /; Design Item ID: TEST_POINT; Source: LuxonisMaster.SchLib

## Sheet IMU.SchDoc: =project_title
size Tabloid; CompanyName: Luxonis Holding; DrawnBy: Boris Chou / Blaz Kvas; Organization: Luxonis Holding; Address1: 1925 Harmony Park Drive; Address2: Westminster, CO; Address3: 80234; Address4: United States; DocumentNumber: D2088000; Revision: R3M1E3; SheetNumber: 4; SheetTotal: 11
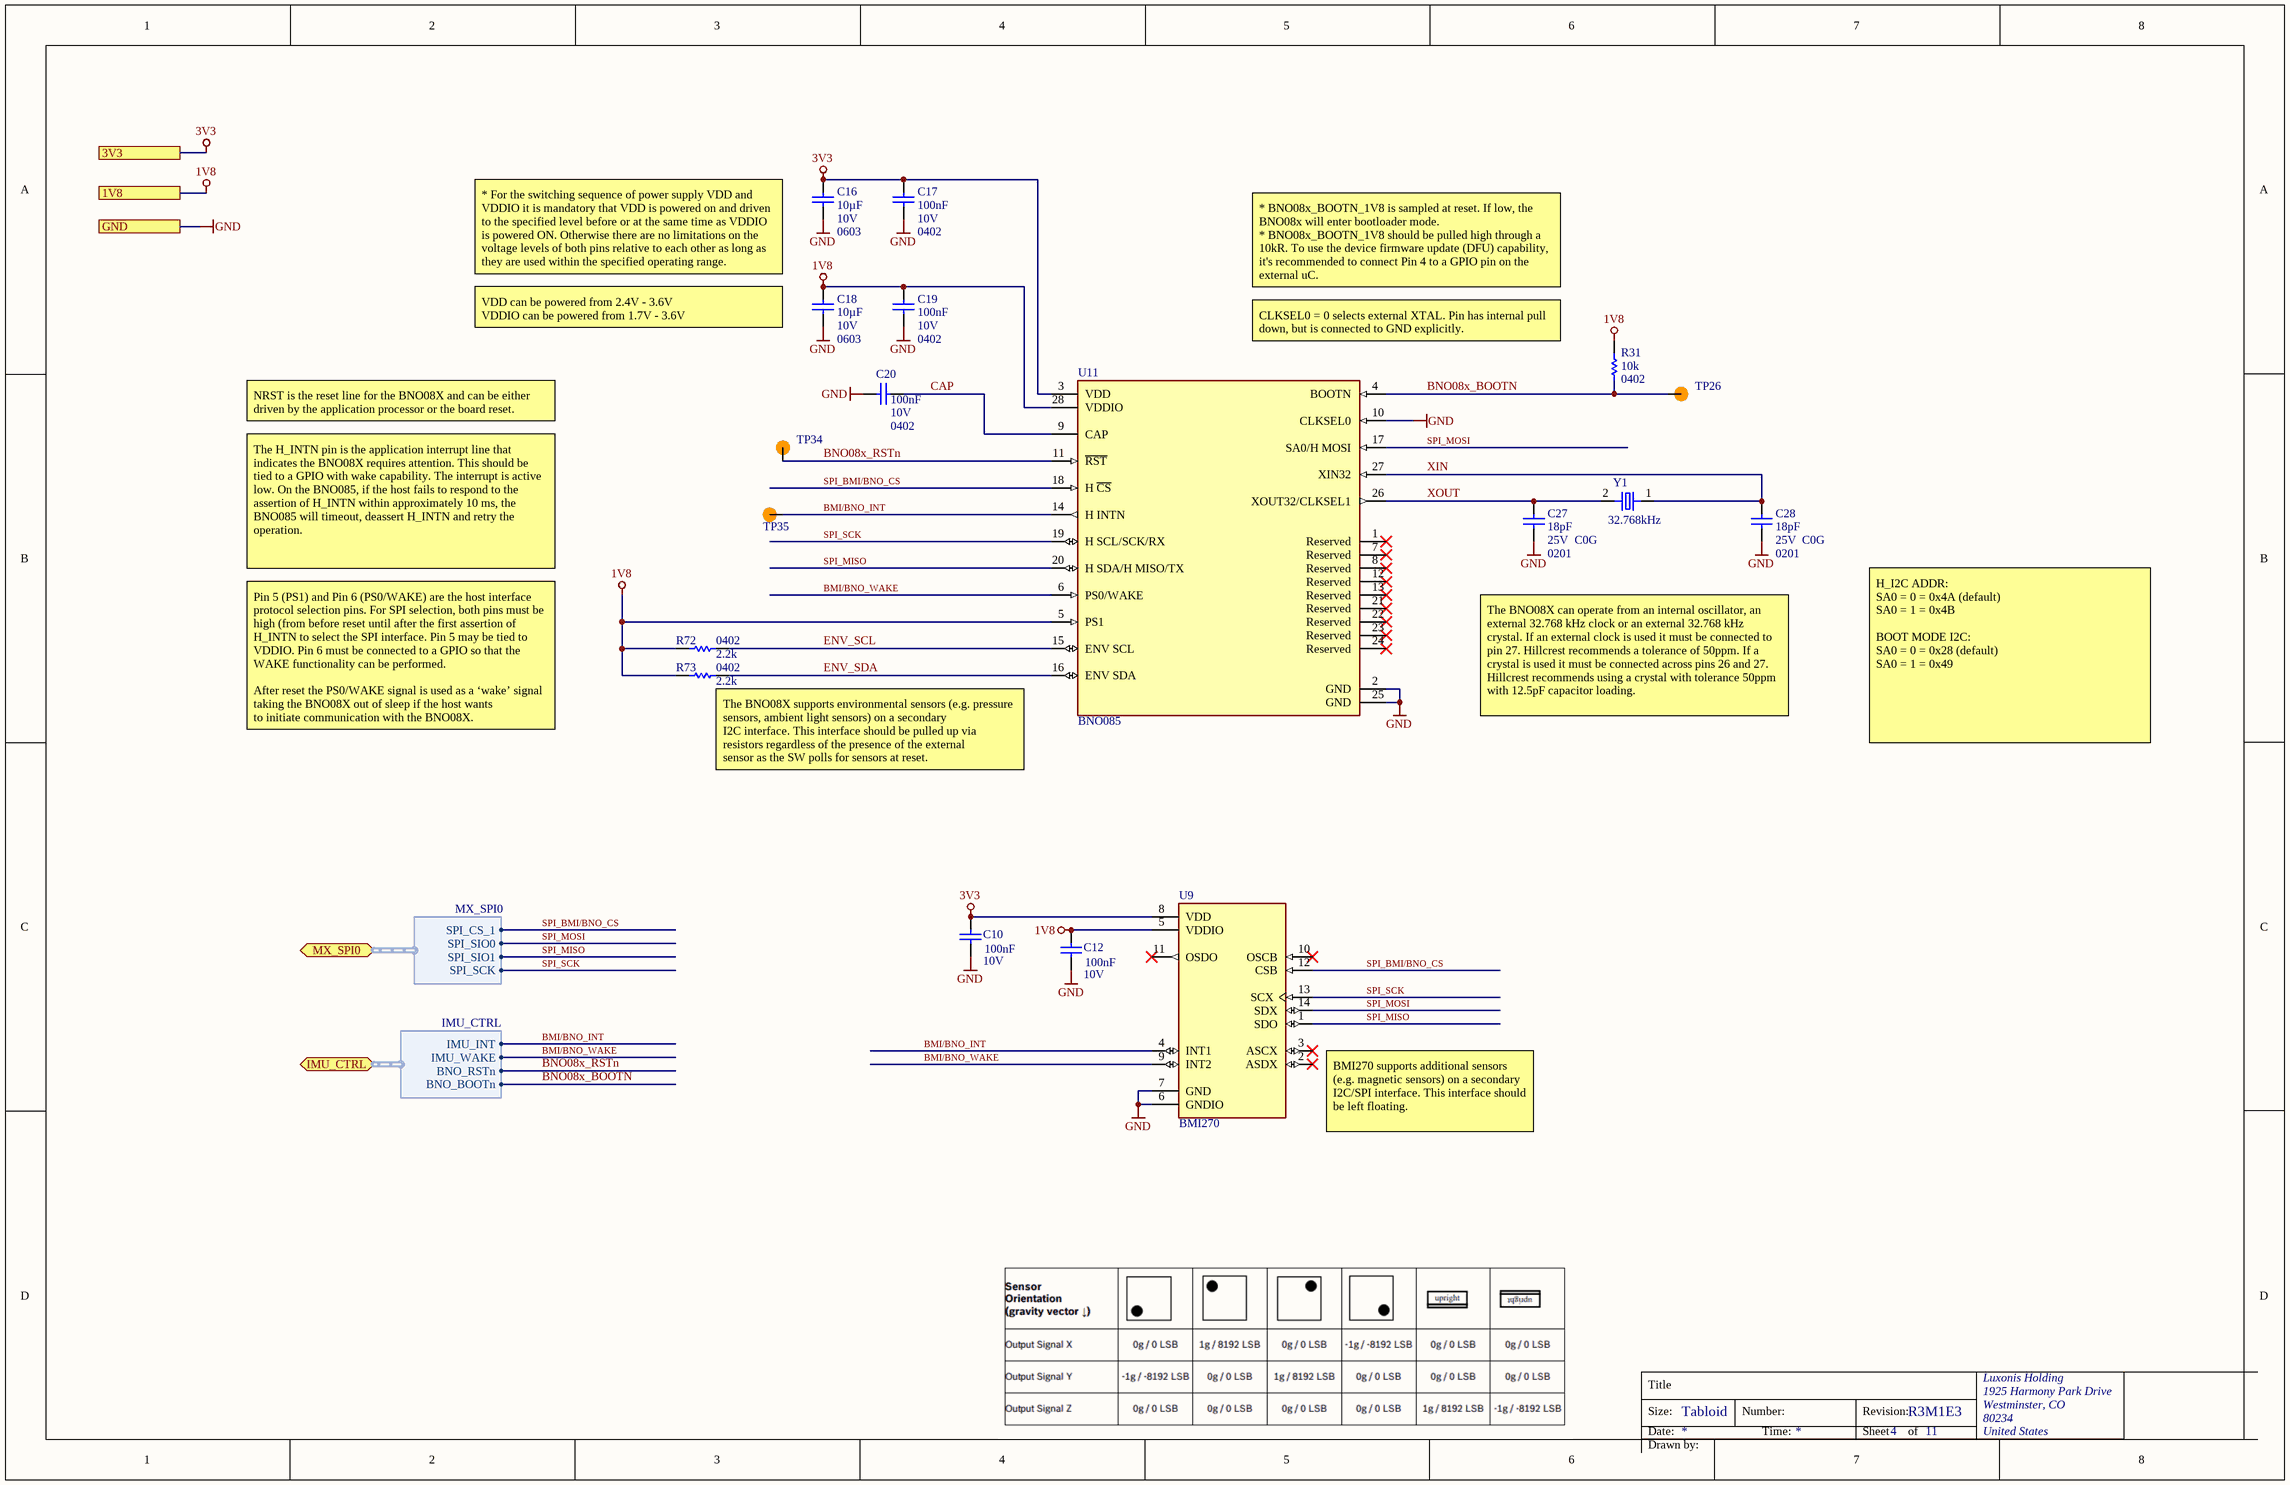
[diagram p13: IMU.SchDoc]

### Parts
C10  value 100nF  Voltage Rating: 10V  [CAPC0402(1005)70_L]  (hidden comment: GRM155R71A104JA01D)
C12  value 100nF  Voltage Rating: 10V  [CAPC0402(1005)70_L]  (hidden comment: GRM155R71A104JA01D)
C16  value 10µF  Case/Package: 0603  Voltage Rating: 10V  [CAPC0603(1608)100_L]  (hidden comment: GRM188R61A106ME69D)
C17  value 100nF  Case/Package: 0402  Voltage Rating: 10V  [CAPC0402(1005)70_N]  (hidden comment: GRM155R71A104JA01D)
C18  value 10µF  Case/Package: 0603  Voltage Rating: 10V  [CAPC0603(1608)100_L]  (hidden comment: GRM188R61A106ME69D)
C19  value 100nF  Case/Package: 0402  Voltage Rating: 10V  [CAPC0402(1005)70_N]  (hidden comment: GRM155R71A104JA01D)
C20  value 100nF  Case/Package: 0402  Voltage Rating: 10V  [CAPC0402(1005)70_N]  (hidden comment: GRM155R71A104JA01D)
C27  value 18pF  Case/Package: 0201  Voltage Rating: 25V  Dielectric: C0G  [CAPC0201(0603)33_L]  (hidden comment: GRM0335C1E180FA01D)
C28  value 18pF  Case/Package: 0201  Voltage Rating: 25V  Dielectric: C0G  [CAPC0201(0603)33_L]  (hidden comment: GRM0335C1E180FA01D)
R31  value 10k  Case/Package: 0402  [RESC0402(1005)_L]  (hidden comment: RC0402FR-1310KL)
R72  value 2.2k  Case/Package: 0402  [RESC0402(1005)_L]  (hidden comment: RC0402FR-072K2L)
R73  value 2.2k  Case/Package: 0402  [RESC0402(1005)_L]  (hidden comment: RC0402FR-072K2L)
TP26  TEST_POINT  [TP100_200_NS]  (value not drawn)  (no BOM)
TP34  TEST_POINT  [TP100_200_NS]  (value not drawn)  (no BOM)
TP35  TEST_POINT  [TP100_200_NS]  (value not drawn)  (no BOM)
U9  BMI270  [XDCR_BMI270]
U11  BNO085  [BNO085]
Y1  Frequency: 32.768kHz  [ABS06-127-32.768KHZ-T]  (hidden comment: ABS06-127-32.768KHZ-T)

### Ports
1V8, 3V3, GND, IMU_CTRL (bidir, harness IMU_CTRL), MX_SPI0 (bidir, harness MX_SPI0)

### Harnesses
MX_SPI0: SPI_SIO0, SPI_SIO1, SPI_CS_1, SPI_SCK
IMU_CTRL: IMU_INT, IMU_WAKE, BNO_RSTn, BNO_BOOTn

### Nets
1V8: C12.2 C18.2 C19.2 R31.2 R72.1 R73.1 U9.5(VDDIO) U11.5(PS1) U11.28(VDDIO) ; port 1V8
3V3: C10.2 C16.2 C17.2 U9.8(VDD) U11.3(VDD) ; port 3V3
GND: C10.1 C12.1 C16.1 C17.1 C18.1 C19.1 C20.2 C27.1 C28.1 U9.6(GNDIO) U9.7(GND) U11.2(GND) U11.10(CLKSEL0) U11.25(GND) ; port GND
BMI/BNO_INT: TP35.1 U9.4(INT1) U11.14(H_INTN) ; port IMU_CTRL.IMU_INT
BMI/BNO_WAKE: U9.9(INT2) U11.6(PS0/WAKE) ; port IMU_CTRL.IMU_WAKE
BNO08x_BOOTN: R31.1 TP26.1 U11.4(BOOTN) ; port IMU_CTRL.BNO_BOOTn
BNO08x_RSTn: TP34.1 U11.11(~{RST}) ; port IMU_CTRL.BNO_RSTn
CAP: C20.1 U11.9(CAP)
ENV_SCL: R72.2 U11.15(ENV_SCL)
ENV_SDA: R73.2 U11.16(ENV_SDA)
SPI_BMI/BNO_CS: U9.12(CSB) U11.18(H_~{CS}) ; port MX_SPI0.SPI_CS_1
SPI_MISO: U9.1(SDO) U11.20(H_SDA/H_MISO/TX) ; port MX_SPI0.SPI_SIO1
SPI_MOSI: U9.14(SDX) U11.17(SA0/H_MOSI) ; port MX_SPI0.SPI_SIO0
SPI_SCK: U9.13(SCX) U11.19(H_SCL/SCK/RX) ; port MX_SPI0.SPI_SCK
XIN: C28.2 U11.27(XIN32) Y1.1
XOUT: C27.2 U11.26(XOUT32/CLKSEL1) Y1.2

Not connected (* = marked no-connect by the designer): U9 2(ASDX)* 3(ASCX)* 10(OSCB)* 11(OSDO)*; U11 1(Reserved)* 7(Reserved)* 8(Reserved)* 12(Reserved)* 13(Reserved)* 21(Reserved)* 22(Reserved)* 23(Reserved)* 24(Reserved)*

### Notes on the sheet
- * For the switching sequence of power supply VDD and VDDIO it is mandatory that VDD is powered on and driven to the specified level before or at the same time as VDDIO is powered ON. Otherwise there are no limitations on the voltage levels of both pins relative to each other as long as they are used within the specified operating range.
- * BNO08x_BOOTN_1V8 is sampled at reset. If low, the BNO08x will enter bootloader mode.
  * BNO08x_BOOTN_1V8 should be pulled high through a 10kR. To use the device firmware update (DFU) capability, it's recommended to connect Pin 4 to a GPIO pin on the external uC.
- (near C18) VDD can be powered from 2.4V - 3.6V
  VDDIO can be powered from 1.7V - 3.6V
- CLKSEL0 = 0 selects external XTAL. Pin has internal pull down, but is connected to GND explicitly.
- NRST is the reset line for the BNO08X and can be either driven by the application processor or the board reset.
- The H_INTN pin is the application interrupt line that indicates the BNO08X requires attention. This should be tied to a GPIO with wake capability. The interrupt is active low. On the BNO085, if the host fails to respond to the assertion of H_INTN within approximately 10 ms, the BNO085 will timeout, deassert H_INTN and retry the operation.
- Pin 5 (PS1) and Pin 6 (PS0/WAKE) are the host interface protocol selection pins. For SPI selection, both pins must be high (from before reset until after the first assertion of H_INTN to select the SPI interface. Pin 5 may be tied to VDDIO. Pin 6 must be connected to a GPIO so that the WAKE functionality can be performed.
  After reset the PS0/WAKE signal is used as a ‘wake’ signal taking the BNO08X out of sleep if the host wants
  to initiate communication with the BNO08X.
- (near R73) The BNO08X supports environmental sensors (e.g. pressure sensors, ambient light sensors) on a secondary
  I2C interface. This interface should be pulled up via resistors regardless of the presence of the external
  sensor as the SW polls for sensors at reset.
- The BNO08X can operate from an internal oscillator, an external 32.768 kHz clock or an external 32.768 kHz crystal. If an external clock is used it must be connected to pin 27. Hillcrest recommends a tolerance of 50ppm. If a crystal is used it must be connected across pins 26 and 27. Hillcrest recommends using a crystal with tolerance 50ppm with 12.5pF capacitor loading.
- H_I2C ADDR:
  SA0 = 0 = 0x4A (default)
  SA0 = 1 = 0x4B
  BOOT MODE I2C:
  SA0 = 0 = 0x28 (default)
  SA0 = 1 = 0x49
- (near U9) BMI270 supports additional sensors (e.g. magnetic sensors) on a secondary I2C/SPI interface. This interface should be left floating.
- Title
- Size:
- Date:
- Tabloid
- Number:
- Time:
- Revision:
- Sheet
- of
- Drawn by:

### Library data of the parts
C10 C12 = CMP-108-000015-5: as C69 on sheet MID_AR0234; Manufacturer Part Number 1: GRM155R71A104JA01D; Case/Package: 0402; Min Operating Temperature: -55°C; Max Operating Temperature: 125°C; Tolerance: 5%; Dielectric: X7R; Length: 1mm; Height: 0.5mm; Width: 0.02inch; Depth: 0.5mm; ComponentLink1URL: https://datasheet.ciiva.com/5411/product-5411135.pdf?src-supplier=Mouser; ComponentLink1Description: https://datasheet.ciiva.com/5411/product-5411135.pdf?src-supplier=Mouser; ComponentLink2URL: https://datasheet.ciiva.com/11618/c02e-11618821.pdf?src-supplier=Avnet; ComponentLink2Description: https://datasheet.ciiva.com/11618/c02e-11618821.pdf?src-supplier=Avnet; Design Item ID: GRM155R71A104JA01D; Mounting Technology: SMT
C16 C18 = CMP-004-000018-4: as C70 on sheet MID_AR0234; Manufacturer Part Number 1: GRM188R61A106ME69D; Min Operating Temperature: -55°C; Max Operating Temperature: 85°C; Tolerance: 20%; Dielectric: X5R; Length: 1.6mm; Height: 0.8mm; Width: 0.8mm; Depth: 0.8mm; ComponentLink1URL: http://www.mouser.com/ds/2/281/c02e-2905.pdf?src-supplier=Mouser; ComponentLink1Description: http://www.mouser.com/ds/2/281/c02e-2905.pdf?src-supplier=Mouser; ComponentLink2URL: http://components.arrow.com/part/dataview/0323_06119472?src-supplier=Arrow+Europe; ComponentLink2Description: http://components.arrow.com/part/dataview/0323_06119472?src-supplier=Arrow+Europe; ComponentLink3URL: http://www.farnell.com/datasheets/2048014.pdf?src-supplier=Farnell; ComponentLink3Description: http://www.farnell.com/datasheets/2048014.pdf?src-supplier=Farnell; ComponentLink4URL: http://www.farnell.com/datasheets/1872210.pdf?src-supplier=Farnell; ComponentLink4Description: http://www.farnell.com/datasheets/1872210.pdf?src-supplier=Farnell; ComponentLink5URL: http://search.murata.co.jp/Ceramy/image/img/A01X/G101/ENG/GRM188R61A106ME69-01.pdf?src-supplier=Digi-Key; ComponentLink5Description: http://search.murata.co.jp/Ceramy/image/img/A01X/G101/ENG/GRM188R61A106ME69-01.pdf?src-supplier=Digi-Key; ComponentLink6URL: http://www.farnell.com/datasheets/1872210.pdf?src-supplier=Newark; ComponentLink6Description: http://www.farnell.com/datasheets/1872210.pdf?src-supplier=Newark; ComponentLink7URL: http://www.farnell.com/datasheets/2048014.pdf?src-supplier=Element14; ComponentLink7Description: http://www.farnell.com/datasheets/2048014.pdf?src-supplier=Element14; ComponentLink8URL: http://www.farnell.com/datasheets/2048014.pdf?src-supplier=Newark; ComponentLink8Description: http://www.farnell.com/datasheets/2048014.pdf?src-supplier=Newark; Design Item ID: GRM188R61A106ME69D; Mounting Technology: SMT
C17 C19 C20 = CMP-108-000015-4: CAP CER 0.1UF 10V X7R 0402 5%; Manufacturer 1: Murata; Manufacturer Part Number 1: GRM155R71A104JA01D; Min Operating Temperature: -55°C; Max Operating Temperature: 125°C; Tolerance: 5%; Dielectric: X7R; Length: 1mm; Height: 0.5mm; Width: 0.02inch; Depth: 0.5mm; ComponentLink1URL: https://datasheet.ciiva.com/5411/product-5411135.pdf?src-supplier=Mouser; ComponentLink1Description: https://datasheet.ciiva.com/5411/product-5411135.pdf?src-supplier=Mouser; ComponentLink2URL: https://datasheet.ciiva.com/11618/c02e-11618821.pdf?src-supplier=Avnet; ComponentLink2Description: https://datasheet.ciiva.com/11618/c02e-11618821.pdf?src-supplier=Avnet; Design Item ID: GRM155R71A104JA01D; Mounting Technology: SMT
C27 C28 = CMP-004-000003-6: CAP CER 18PF 25V C0G 0201 10%; Manufacturer 1: Murata; Tolerance: 1%; Manufacturer Part Number 1: GRM0335C1E180FA01D; Min Operating Temperature: -55°C; Max Operating Temperature: 125°C; Length: 0.024inch; Height: 0.3mm; Width: 0.3mm; ComponentLink1URL: https://datasheet.ciiva.com/29538/partnumbering-e-01-29538328.pdf?src-supplier=Digi-Key; ComponentLink1Description: https://datasheet.ciiva.com/29538/partnumbering-e-01-29538328.pdf?src-supplier=Digi-Key; Design Item ID: GRM0335C1E180FA01D; Mounting Technology: SMT
R31 = CMP-115-000004-7: RES SMD 10K OHM 1% 1/16W 0402; Manufacturer 1: Yageo; Temperature Coefficient: 100ppm/°C; Power Rating: 62.5mW; Voltage Rating: 50V; Manufacturer Part Number 1: RC0402FR-1310KL; Min Operating Temperature: -55°C; Max Operating Temperature: 155°C; Tolerance: 1%; Design Item ID: RC0402FR-1310KL
R72 R73 = CMP-013-000013-8: RES SMD 2.2K OHM 1% 1/16W 0402; Manufacturer 1: Yageo; Power Rating: 63mW; Voltage Rating: 50V; Manufacturer Part Number 1: RC0402FR-072K2L; Min Operating Temperature: -55°C; Max Operating Temperature: 155°C; Tolerance: 1%; Design Item ID: RC0402FR-072K2L
TP26 TP34 TP35 = CMP-015-000000-2: Manufacturer Part Number 1: /; Design Item ID: TEST_POINT; Source: LuxonisMaster.SchLib
U9 = CMP-061-000001-2: Accelerometer, Gyroscope, 6 Axis Sensor IÂ²C, SPI Output; Manufacturer 1: Bosch Sensortec; Manufacturer Part Number 1: BMI270
U11 = CMP-016-000000-2: IMU ACCEL/GYRO/MAG I2C 32BIT; Manufacturer 1: Hillcrest Laboratories; Sensor Type: Accelerometer,Gyroscope,Magnetometer; Manufacturer Part Number 1: BNO085; Case/Package: LGA
Y1 = CMP-006-000001-2: CRYSTAL 32.768kHz ±20ppm Crystal 12.5pF 90 kOhms 2-SMD, No Lead; Manufacturer 1: Abracon; Manufacturer Part Number 1: ABS06-127-32.768KHZ-T; Case/Package: SMD/SMT; Min Operating Temperature: -40°C; Max Operating Temperature: 85°C; Tolerance: 20ppm

## Sheet EEPROM.SchDoc: =project_title
size Tabloid; PageSetup: Record=PageOptions|CenterHorizontal=True|CenterVertical=True|PrintScale=0.73|XCorrection=1.00|YCorrection=1.00|PrintKind=0|BorderSize=5000000|LeftOffset=0|BottomOffset=0|Orientation=2|PaperLength=1000|PaperWidth=1000|Scale=100|PaperSource=7|PrintQuality=-4|MediaType=1|DitherType=10|PaperKind=A4|PrintScaleMode=1; CompanyName: Luxonis Holding; DrawnBy: Boris Chou / Blaz Kvas; Organization: Luxonis Holding; Address1: 1925 Harmony Park Drive; Address2: Westminster, CO; Address3: 80234; Address4: United States; DocumentNumber: D2088000; Revision: R3M1E3; SheetNumber: 8; SheetTotal: 12
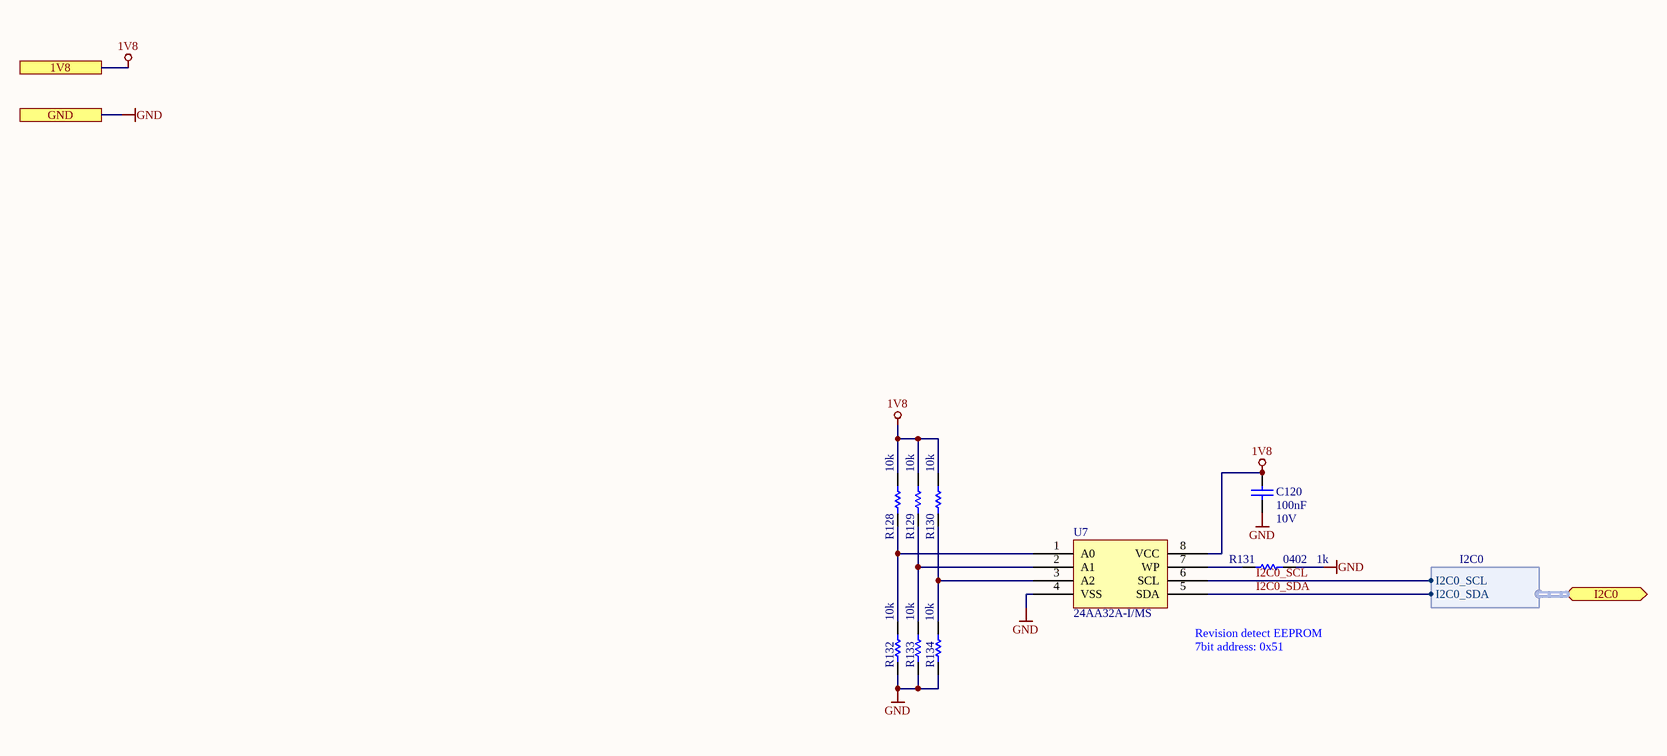
[diagram p14: EEPROM.SchDoc]

### Parts
C120  value 100nF  Voltage Rating: 10V  [CAPC0402(1005)70_L]  (hidden comment: GRM155R71A104JA01D)
R128  value 10k  [RESC0402(1005)_L]  (hidden comment: RC0402FR-1310KL)
R129  value 10k  [RESC0402(1005)_L]  (hidden comment: RC0402FR-1310KL)
R130  value 10k  [RESC0402(1005)_L]  (hidden comment: RC0402FR-1310KL)
R131  value 1k  Case/Package: 0402  [RESC0402(1005)_L]  (hidden comment: RC0402FR-071KL)
R132  value 10k  [RESC0402(1005)_L]  (hidden comment: RC0402FR-1310KL)
R133  value 10k  [RESC0402(1005)_L]  (hidden comment: RC0402FR-1310KL)
R134  value 10k  [RESC0402(1005)_L]  (hidden comment: RC0402FR-1310KL)
U7  24AA32A-I/MS  [24AA32A-I/MS]

### Ports
1V8, GND, I2C0 (bidir, harness I2C0)

### Harnesses
I2C0: I2C0_SCL, I2C0_SDA

### Nets
1V8: C120.2 R128.2 R129.2 R130.2 U7.8(VCC) ; port 1V8
GND: C120.1 R131.1 R132.1 R133.1 R134.1 U7.4(VSS) ; port GND
I2C0_SCL: U7.6(SCL) ; port I2C0.I2C0_SCL
I2C0_SDA: U7.5(SDA) ; port I2C0.I2C0_SDA
NetR128_1: R128.1 R132.2 U7.1(A0)
NetR129_1: R129.1 R133.2 U7.2(A1)
NetR130_1: R130.1 R134.2 U7.3(A2)
NetR131_2: R131.2 U7.7(WP)

### Notes on the sheet
- (near U7) Revision detect EEPROM
- (near U7) 7bit address: 0x51
- Title
- Size:
- Date:
- Tabloid
- Number:
- Time:
- Revision:
- Sheet
- of
- Drawn by:

### Library data of the parts
C120 = CMP-108-000015-5: as C69 on sheet MID_AR0234; Manufacturer Part Number 1: GRM155R71A104JA01D; Case/Package: 0402; Min Operating Temperature: -55°C; Max Operating Temperature: 125°C; Tolerance: 5%; Dielectric: X7R; Length: 1mm; Height: 0.5mm; Width: 0.02inch; Depth: 0.5mm; ComponentLink1URL: https://datasheet.ciiva.com/5411/product-5411135.pdf?src-supplier=Mouser; ComponentLink1Description: https://datasheet.ciiva.com/5411/product-5411135.pdf?src-supplier=Mouser; ComponentLink2URL: https://datasheet.ciiva.com/11618/c02e-11618821.pdf?src-supplier=Avnet; ComponentLink2Description: https://datasheet.ciiva.com/11618/c02e-11618821.pdf?src-supplier=Avnet; Design Item ID: GRM155R71A104JA01D; Mounting Technology: SMT
R128-R130 R132-R134 = CMP-115-000004-8: as R54 on sheet MID_AR0234; Manufacturer Part Number 1: RC0402FR-1310KL; Case/Package: 0402; Min Operating Temperature: -55°C; Max Operating Temperature: 155°C; Tolerance: 1%; Design Item ID: RC0402FR-1310KL
R131 = CMP-013-000004-10: RES SMD 1K OHM 1% 1/16W 0402; Manufacturer 1: Yageo; Power Rating: 62.5mW; Voltage Rating: 50V; Min Operating Temperature: -55°C; Max Operating Temperature: 155°C; Manufacturer Part Number 1: RC0402FR-071KL; Tolerance: 1%; Design Item ID: RC0402FR-071KL
U7 = CMP-010-000010-2: IC EEPROM 32K I2C 400KHZ 8MSOP Memory IC 32Kb (4K x 8) I²C 400kHz 900ns 8-MSOP; Manufacturer 1: Microchip; Case/Package: MSOP; Frequency: 400kHz; Memory Size: 32Kb; Manufacturer Part Number 1: 24AA32A-I/MS; Pins: 8

## Nets that join several sheets
1V2: POWER_GEN (5 pins), MID_AR0234 (FB12.1), RIGHT_AR0234 (FB9.1), LEFT_AR0234 (FB6.1)
1V8: CONNECTOR_B (9 pins), CONNECTOR_A (R32.2), ETH_PCIE_PHY (C52.2 R50.2 U6.3), BOOT_JTAG_AUX (J4.7 P1.1), POWER_GEN (C60.2 TP16.1 U10.5), MID_AR0234 (FB11.1), RIGHT_AR0234 (FB8.1), LEFT_AR0234 (FB5.1), IMU (9 pins), EEPROM (5 pins)
2V8: POWER_GEN (C66.2 TP23.1 U14.1), MID_AR0234 (FB10.1), RIGHT_AR0234 (FB7.1), LEFT_AR0234 (FB4.1)
3V3: ETH_PCIE_PHY (15 pins), RJ45 (D16.2 J1.15 J1.17), USB (7 pins), BOOT_JTAG_AUX (C55.2 J4.9 J7.4), POWER_GEN (8 pins), IMU (5 pins)
5V_PoE: PoE_Si3404 (7 pins), POWER_GEN (5 pins)
GND: TopLevel (5 pins), CONNECTOR_B (36 pins), CONNECTOR_A (33 pins), ETH_PCIE_PHY (26 pins), RJ45 (7 pins), USB (28 pins), BOOT_JTAG_AUX (18 pins), PoE_Si3404 (9 pins), POWER_GEN (22 pins), MID_AR0234 (19 pins), RIGHT_AR0234 (19 pins), LEFT_AR0234 (19 pins), IMU (14 pins), EEPROM (6 pins)
VBUS: CONNECTOR_B (J3.80), USB (11 pins), POWER_GEN (R69.2 TP20.1 U8.1)
VDD_5V: CONNECTOR_B (8 pins), USB (C76.2 R213.2 R214.2 U62.12), BOOT_JTAG_AUX (D3.2 D7.2 D12.1 R55.2), POWER_GEN (14 pins)
VNEG_IN: RJ45 (D1.4 D8.4), PoE_Si3404 (C33.1 FB3.1)
2485_PGOOD: CONNECTOR_A (J2.37), BOOT_JTAG_AUX (J5.5 Q2.1)
2485_WAKEUP: CONNECTOR_A (J2.41 R62.1), BOOT_JTAG_AUX (J5.7)
BMI/BNO_INT: CONNECTOR_B (J3.66), IMU (TP35.1 U9.4 U11.14)
BMI/BNO_WAKE: CONNECTOR_B (J3.72), IMU (U9.9 U11.6)
BNO08x_BOOTN: CONNECTOR_B (J3.54), IMU (R31.1 TP26.1 U11.4)
BNO08x_RSTn: CONNECTOR_B (J3.44), IMU (TP34.1 U11.11)
BOOT0/LED_B: CONNECTOR_B (J3.26 R16.1 R23.2), BOOT_JTAG_AUX (Q6.1)
BOOT2/LED_R: CONNECTOR_B (J3.22 R7.1 R21.2 R45.2), BOOT_JTAG_AUX (Q3.1)
BOOT7/LED_G: CONNECTOR_B (J3.28 R68.1 R80.2 R81.2), BOOT_JTAG_AUX (Q5.1)
BRIDGE_REFCLK_N: CONNECTOR_B (J3.81), ETH_PCIE_PHY (R25.2)
BRIDGE_REFCLK_P: CONNECTOR_B (J3.83), ETH_PCIE_PHY (R6.2)
CAM_A_CLK_OUT: CONNECTOR_A (J2.28), MID_AR0234 (J6.3)
CAM_A_PWDN_N: CONNECTOR_A (J2.34), MID_AR0234 (J6.9 R70.2)
CAM_B_CLK_OUT: CONNECTOR_A (J2.73), RIGHT_AR0234 (J9.3), LEFT_AR0234 (J10.3)
CAM_B_PWDN_N: CONNECTOR_A (J2.67), LEFT_AR0234 (J10.9 R37.1)
CAM_R_PWM: CONNECTOR_B (J3.74), RIGHT_AR0234 (J9.9 R43.2)
COM_AUX_IO2: CONNECTOR_B (R83.1), CONNECTOR_A (R82.1), BOOT_JTAG_AUX (J5.8), LEFT_AR0234 (R39.2)
FSIN2: RIGHT_AR0234 (J9.8), LEFT_AR0234 (R77.2)
FSIN3: MID_AR0234 (J6.8), LEFT_AR0234 (R38.2)
GPIO7/sd_hst_cd: CONNECTOR_A (J2.59), BOOT_JTAG_AUX (R66.2)
I2C0_SCL: CONNECTOR_B (J3.34), BOOT_JTAG_AUX (TP1.1), EEPROM (U7.6)
I2C0_SDA: CONNECTOR_B (J3.36), BOOT_JTAG_AUX (TP2.1), EEPROM (U7.5)
I2C1_SCL: CONNECTOR_A (J2.35), MID_AR0234 (J6.7)
I2C1_SDA: CONNECTOR_A (J2.33), MID_AR0234 (J6.5)
I2C2_SCL: CONNECTOR_A (J2.77), LEFT_AR0234 (J10.7)
I2C2_SDA: CONNECTOR_A (J2.79), LEFT_AR0234 (J10.5)
I2C3_SCL: CONNECTOR_A (J2.78), BOOT_JTAG_AUX (J5.2), RIGHT_AR0234 (J9.7)
I2C3_SDA: CONNECTOR_A (J2.80), BOOT_JTAG_AUX (J5.4), RIGHT_AR0234 (J9.5)
I2C4_SCL_1V8: CONNECTOR_B (J3.59), BOOT_JTAG_AUX (P1.3)
I2C4_SDA_1V8: CONNECTOR_B (J3.57), BOOT_JTAG_AUX (P1.2)
LED0_10_GRN: ETH_PCIE_PHY (U4.27), RJ45 (R57.1)
LED1_100_OR: ETH_PCIE_PHY (U4.26), RJ45 (R58.1)
LED2_1000_GRN: ETH_PCIE_PHY (U4.25), RJ45 (R59.1)
MD1_N: ETH_PCIE_PHY (U4.2), RJ45 (D17.2 D17.9 J1.2)
MD1_P: ETH_PCIE_PHY (U4.1), RJ45 (D17.1 D17.10 J1.1)
MD2_N: ETH_PCIE_PHY (U4.5), RJ45 (D17.5 D17.6 J1.6)
MD2_P: ETH_PCIE_PHY (U4.4), RJ45 (D17.4 D17.7 J1.3)
MD3_N: ETH_PCIE_PHY (U4.7), RJ45 (D18.2 D18.9 J1.8)
MD3_P: ETH_PCIE_PHY (U4.6), RJ45 (D18.1 D18.10 J1.7)
MD4_N: ETH_PCIE_PHY (U4.10), RJ45 (D18.5 D18.6 J1.10)
MD4_P: ETH_PCIE_PHY (U4.9), RJ45 (D18.4 D18.7 J1.9)
MIPI_RX2_C_N: CONNECTOR_A (J2.95), LEFT_AR0234 (J10.20)
MIPI_RX2_C_P: CONNECTOR_A (J2.97), LEFT_AR0234 (J10.19)
MIPI_RX2_D0_N: CONNECTOR_A (J2.89), LEFT_AR0234 (J10.26)
MIPI_RX2_D0_P: CONNECTOR_A (J2.91), LEFT_AR0234 (J10.25)
MIPI_RX2_D1_N: CONNECTOR_A (J2.83), LEFT_AR0234 (J10.22)
MIPI_RX2_D1_P: CONNECTOR_A (J2.85), LEFT_AR0234 (J10.23)
MIPI_RX3_C_N: CONNECTOR_A (J2.96), RIGHT_AR0234 (J9.20)
MIPI_RX3_C_P: CONNECTOR_A (J2.98), RIGHT_AR0234 (J9.19)
MIPI_RX3_D0_N: CONNECTOR_A (J2.90), RIGHT_AR0234 (J9.26)
MIPI_RX3_D0_P: CONNECTOR_A (J2.92), RIGHT_AR0234 (J9.25)
MIPI_RX3_D1_N: CONNECTOR_A (J2.84), RIGHT_AR0234 (J9.22)
MIPI_RX3_D1_P: CONNECTOR_A (J2.86), RIGHT_AR0234 (J9.23)
MIPI_RX4_C_N: CONNECTOR_A (J2.3), MID_AR0234 (J6.20)
MIPI_RX4_C_P: CONNECTOR_A (J2.5), MID_AR0234 (J6.19)
MIPI_RX4_D0_N: CONNECTOR_A (J2.9), MID_AR0234 (J6.26)
MIPI_RX4_D0_P: CONNECTOR_A (J2.11), MID_AR0234 (J6.25)
MIPI_RX4_D1_N: CONNECTOR_A (J2.15), MID_AR0234 (J6.22)
MIPI_RX4_D1_P: CONNECTOR_A (J2.17), MID_AR0234 (J6.23)
MIPI_RX5_D0_N: CONNECTOR_A (J2.21), MID_AR0234 (J6.16)
MIPI_RX5_D0_P: CONNECTOR_A (J2.23), MID_AR0234 (J6.17)
MIPI_RX5_D1_N: CONNECTOR_A (J2.27), MID_AR0234 (J6.14)
MIPI_RX5_D1_P: CONNECTOR_A (J2.29), MID_AR0234 (J6.13)
MODULE_nRST: CONNECTOR_A (B1.2 J2.39), BOOT_JTAG_AUX (J5.1 Q4.1)
PCIe_CLKREQ_N_1V8: CONNECTOR_B (J3.65), ETH_PCIE_PHY (U6.4)
PCIe_ISOLATE_N_1V8: CONNECTOR_B (R27.2), ETH_PCIE_PHY (U6.5)
PCIe_PERST_1V8: CONNECTOR_B (J3.68), ETH_PCIE_PHY (Q1.1)
sd_hst0_clk: CONNECTOR_A (J2.61), BOOT_JTAG_AUX (J7.5)
sd_hst0_cmd: CONNECTOR_A (J2.63), BOOT_JTAG_AUX (J7.3)
sd_hst0_dat_0: CONNECTOR_A (J2.40), BOOT_JTAG_AUX (J7.7)
sd_hst0_dat_1: CONNECTOR_A (J2.38), BOOT_JTAG_AUX (J7.8)
sd_hst0_dat_2: CONNECTOR_A (J2.36), BOOT_JTAG_AUX (J7.1)
sd_hst0_dat_3: CONNECTOR_A (J2.32), BOOT_JTAG_AUX (J7.2)
SDS_RXD_N: CONNECTOR_B (J3.77), ETH_PCIE_PHY (C51.1)
SDS_RXD_P: CONNECTOR_B (J3.75), ETH_PCIE_PHY (C35.1)
SDS_TXD_N: CONNECTOR_B (J3.71), ETH_PCIE_PHY (U4.14)
SDS_TXD_P: CONNECTOR_B (J3.69), ETH_PCIE_PHY (U4.13)
SPI_BMI/BNO_CS: CONNECTOR_A (J2.60 R32.1 TP30.1), IMU (U9.12 U11.18)
SPI_MISO: CONNECTOR_A (J2.64 TP28.1), IMU (U9.1 U11.20)
SPI_MOSI: CONNECTOR_A (J2.62 TP29.1), IMU (U9.14 U11.17)
SPI_SCK: CONNECTOR_A (J2.74 TP27.1), IMU (U9.13 U11.19)
STRBL: BOOT_JTAG_AUX (J5.6), LEFT_AR0234 (J10.10 TP15.1)
SYS_RST: CONNECTOR_B (J3.89), BOOT_JTAG_AUX (J4.6)
TCK: CONNECTOR_B (J3.97), BOOT_JTAG_AUX (J4.2)
TDI: CONNECTOR_B (J3.95), BOOT_JTAG_AUX (J4.3)
TDO: CONNECTOR_B (J3.91), BOOT_JTAG_AUX (J4.5)
TMS: CONNECTOR_B (J3.99), BOOT_JTAG_AUX (J4.1)
TRST: CONNECTOR_B (J3.93), BOOT_JTAG_AUX (J4.4)
USB_D_N: CONNECTOR_B (J3.90), USB (D11.2 D11.9 J8.A7 J8.B7)
USB_D_P: CONNECTOR_B (J3.92), USB (D11.1 D11.10 J8.A6 J8.B6)
USB_RX_N: CONNECTOR_B (J3.96), USB (U61.4)
USB_RX_P: CONNECTOR_B (J3.98), USB (U61.3)
USB_TX_N: CONNECTOR_B (J3.84), USB (U61.8)
USB_TX_P: CONNECTOR_B (J3.86), USB (U61.7)
VPOS_IN: RJ45 (D1.1 D8.1), PoE_Si3404 (C33.2 FB2.1)